# EAGLE design board (EAGLE 8.5.2)
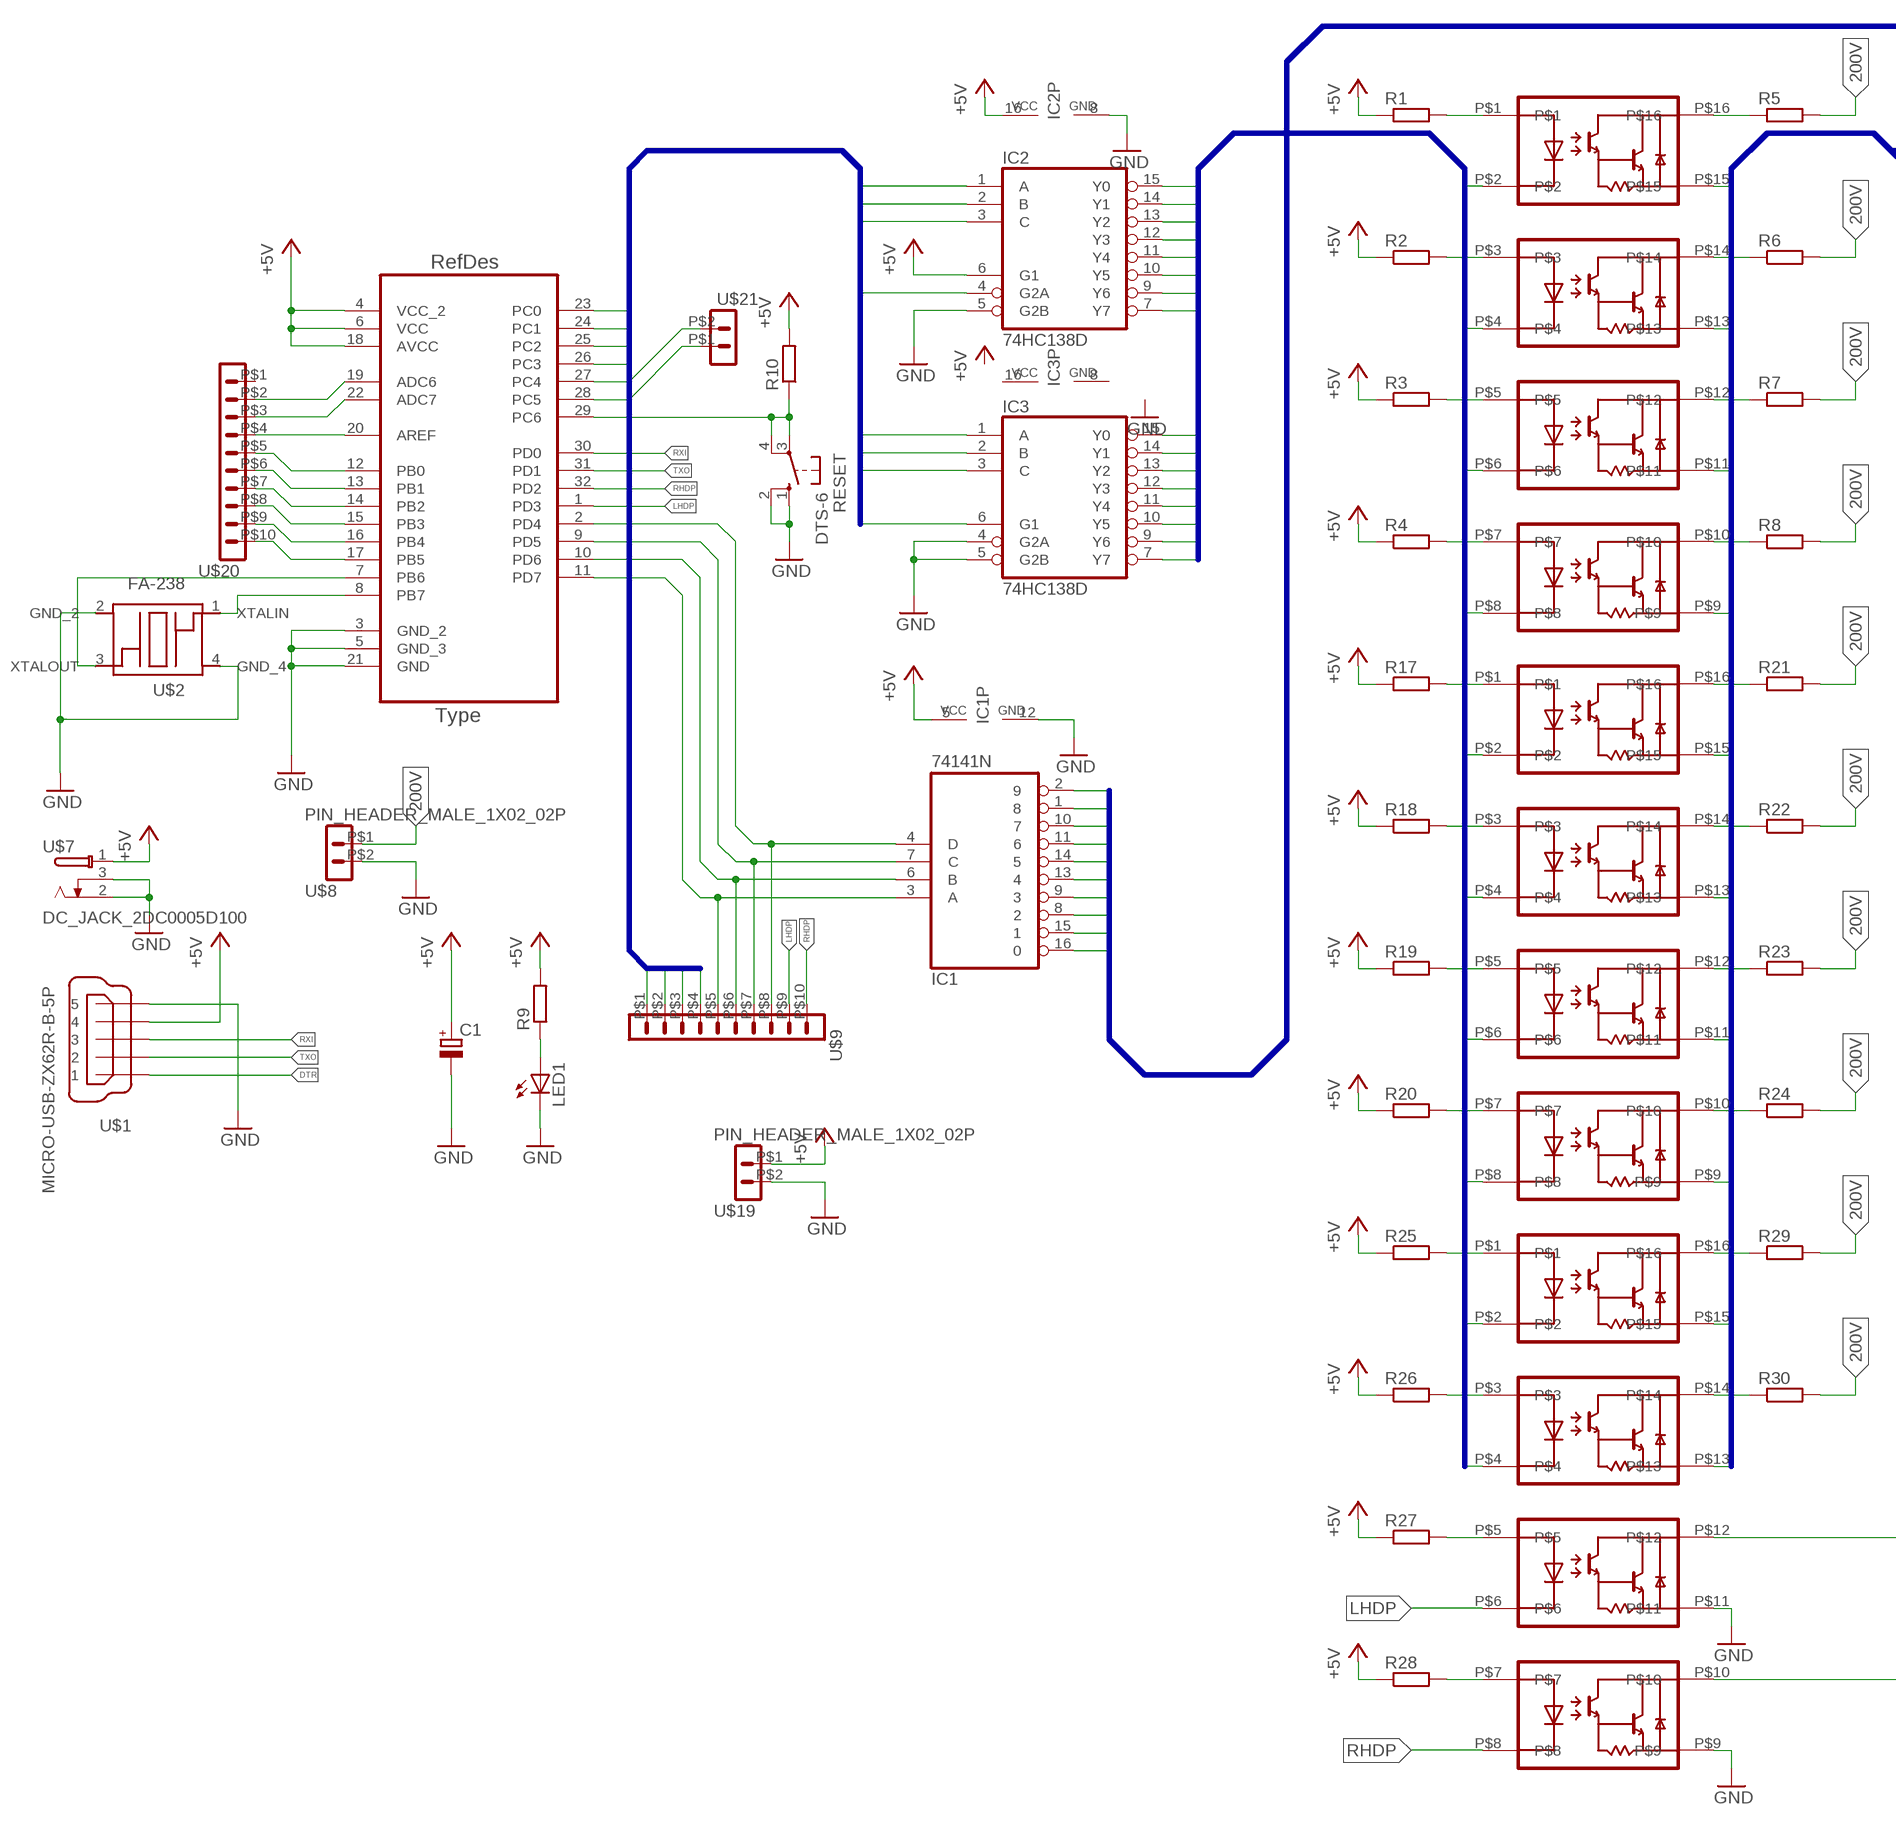
[diagram p0: schematic, sheet 1, part 1 of 2]
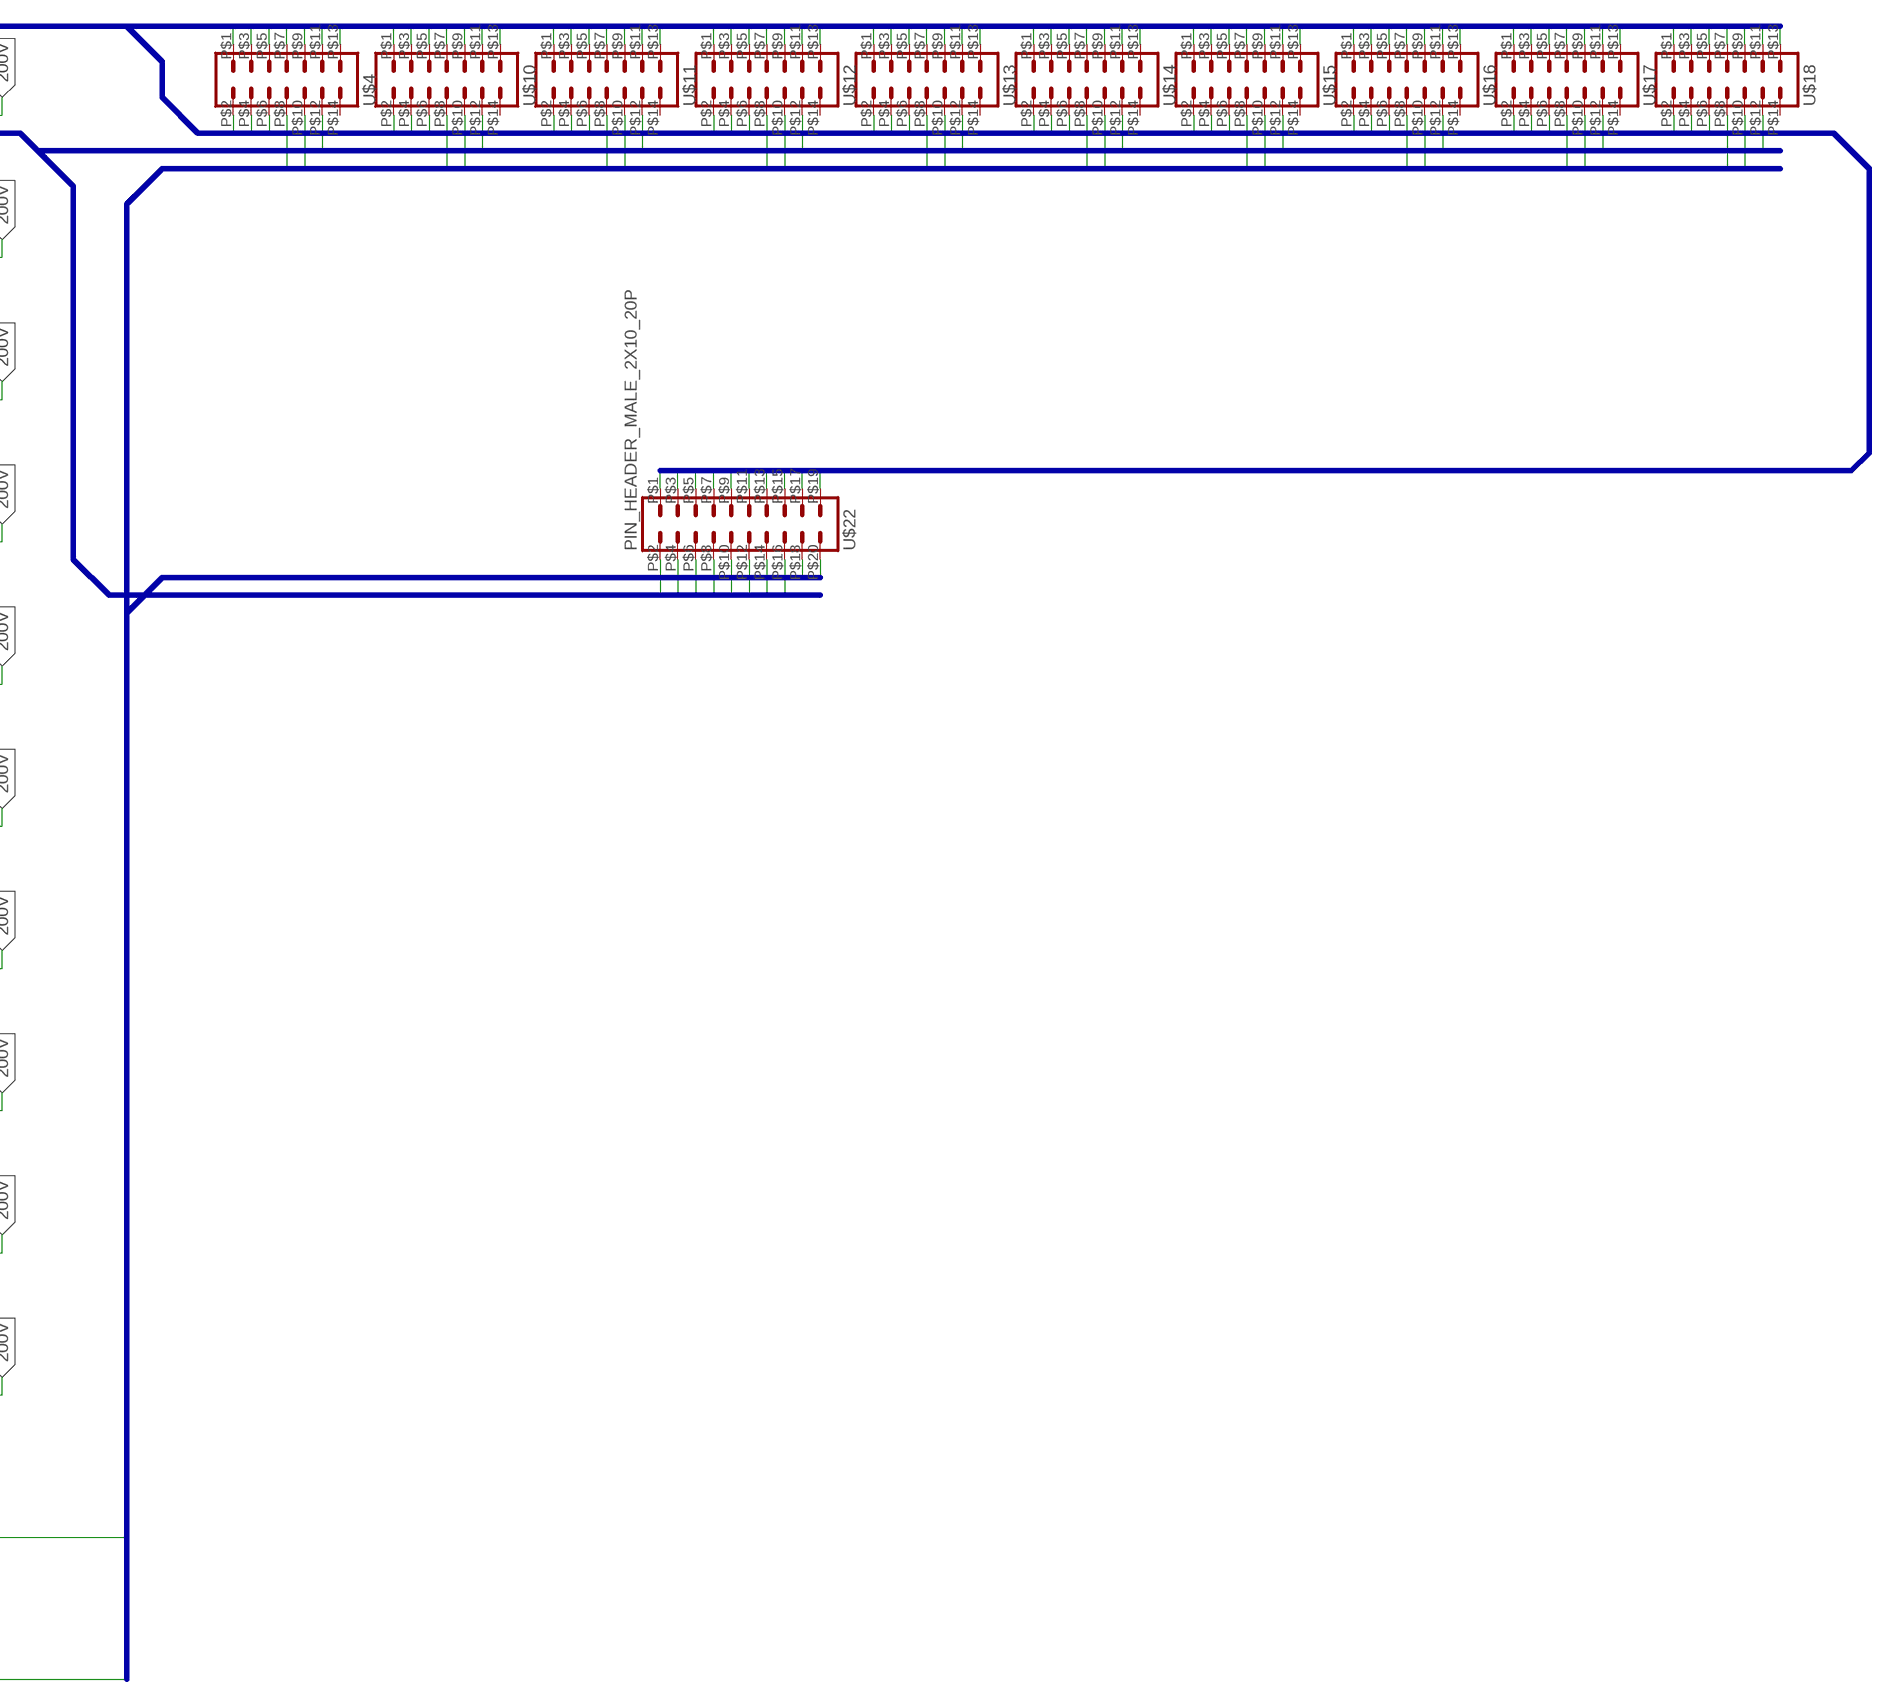
[diagram p1: schematic, sheet 1, part 2 of 2]

## Parts
C1  CPOL-EUE5-8.5  [E5-8,5]
IC1  74141N  [DIL16]
IC2  74HC138D  [SO16]
IC3  74HC138D  [SO16]
LED1  LEDSMT1206  [1206]
R1  R-EU_M3216  [M3216]
R2  R-EU_M3216  [M3216]
R3  R-EU_M3216  [M3216]
R4  R-EU_M3216  [M3216]
R5  R-EU_M3216  [M3216]
R6  R-EU_M3216  [M3216]
R7  R-EU_M3216  [M3216]
R8  R-EU_M3216  [M3216]
R9  R-EU_R3216  [R3216]
R10  R-EU_R3216  [R3216]
R17  R-EU_M3216  [M3216]
R18  R-EU_M3216  [M3216]
R19  R-EU_M3216  [M3216]
R20  R-EU_M3216  [M3216]
R21  R-EU_M3216  [M3216]
R22  R-EU_M3216  [M3216]
R23  R-EU_M3216  [M3216]
R24  R-EU_M3216  [M3216]
R25  R-EU_M3216  [M3216]
R26  R-EU_M3216  [M3216]
R27  R-EU_M3216  [M3216]
R28  R-EU_M3216  [M3216]
R29  R-EU_M3216  [M3216]
R30  R-EU_M3216  [M3216]
RESET  DTS-6  [DTS6]
U1  ATMEGA328P-AU  [QFP80P900X900X120-32N]
U$1  MICRO-USB-ZX62R-B-5P  [ZX62R-B-5P]
U$2  FA-238  [FA-238]
U$3  TLP627-4  [TLP627-4]
U$4  PIN_HEADER_MALE_2X07_14P  [PIN_HEADER_MALE_2X07_14P]
U$5  TLP627-4  [TLP627-4]
U$6  TLP627-4  [TLP627-4]
U$7  DC_JACK_2DC0005D100  [DC_JACK_2DC0005D100]
U$8  PIN_HEADER_MALE_1X02_02P  [PIN_HEADER_MALE_1X02_02P]
U$9  PIN_HEADER_MALE_1X10_10P  [PIN_HEADER_MALE_1X10_10P]
U$10  PIN_HEADER_MALE_2X07_14P  [PIN_HEADER_MALE_2X07_14P]
U$11  PIN_HEADER_MALE_2X07_14P  [PIN_HEADER_MALE_2X07_14P]
U$12  PIN_HEADER_MALE_2X07_14P  [PIN_HEADER_MALE_2X07_14P]
U$13  PIN_HEADER_MALE_2X07_14P  [PIN_HEADER_MALE_2X07_14P]
U$14  PIN_HEADER_MALE_2X07_14P  [PIN_HEADER_MALE_2X07_14P]
U$15  PIN_HEADER_MALE_2X07_14P  [PIN_HEADER_MALE_2X07_14P]
U$16  PIN_HEADER_MALE_2X07_14P  [PIN_HEADER_MALE_2X07_14P]
U$17  PIN_HEADER_MALE_2X07_14P  [PIN_HEADER_MALE_2X07_14P]
U$18  PIN_HEADER_MALE_2X07_14P  [PIN_HEADER_MALE_2X07_14P]
U$19  PIN_HEADER_MALE_1X02_02P  [PIN_HEADER_MALE_1X02_02P]
U$20  PIN_HEADER_MALE_1X10_10P  [PIN_HEADER_MALE_1X10_10P]
U$21  PIN_HEADER_MALE_1X02_02P  [PIN_HEADER_MALE_1X02_02P]
U$22  PIN_HEADER_MALE_2X10_20P  [PIN_HEADER_MALE_2X10_20P]

## Nets
200V: R5.2 R6.2 R7.2 R8.2 R21.2 R22.2 R23.2 R24.2 R29.2 R30.2 U$8.P$1
+5V: C1.+ IC1.5(VCC) IC2.6(G1) IC2.16(VCC) R1.1 R2.1 R3.1 R4.1 R9.2 R10.2 R17.1 R18.1 R19.1 R20.1 R25.1 R26.1 R27.1 R28.1 U1.4(VCC_2) U1.6(VCC) U1.18(AVCC) U$1.4 U$7.1 U$19.P$1
ANODE0: IC2.15(Y0) U$3.P$2
ANODE1: IC2.14(Y1) U$3.P$4
ANODE2: IC2.13(Y2) U$3.P$6
ANODE3: IC2.12(Y3) U$3.P$8
ANODE4: IC2.10(Y5) U$5.P$2
ANODE5: IC2.11(Y4) U$5.P$4
ANODE6: IC2.9(Y6) U$5.P$6
ANODE7: IC2.7(Y7) U$5.P$8
ANODE8: IC3.15(Y0) U$6.P$2
ANODE9: IC3.14(Y1) U$6.P$4
ANODE10: IC3.13(Y2)
ANODE11: IC3.12(Y3)
ANODE12: IC3.11(Y4)
ANODE13: IC3.10(Y5)
ANODE14: IC3.9(Y6)
ANODE15: IC3.7(Y7)
DOT0: U$4.P$8 U$6.P$12 U$10.P$8 U$11.P$8 U$12.P$8 U$13.P$8 U$14.P$8 U$15.P$8 U$16.P$8 U$17.P$8 U$18.P$8 U$22.P$18
DOT1: U$4.P$10 U$6.P$10 U$10.P$10 U$11.P$10 U$12.P$10 U$13.P$10 U$14.P$10 U$15.P$10 U$16.P$10 U$17.P$10 U$18.P$10 U$22.P$20
DTR: U$1.1
GND: C1.- IC1.12(GND) IC2.5(G2B) IC2.8(GND) IC3.4(G2A) IC3.5(G2B) LED1.C RESET.1(S) RESET.2(S1) U1.3(GND_2) U1.5(GND_3) U1.21(GND) U$1.5 U$2.2(GND_2) U$2.4(GND_4) U$6.P$9 U$6.P$11 U$7.2 U$7.3 U$8.P$2 U$19.P$2
LHDP: U1.1(PD3) U$6.P$6
N$1: U1.7(PB6) U$2.3(XTALOUT)
N$2: U1.8(PB7) U$2.1(XTALIN)
N$3: IC1.3(A) U1.11(PD7) U$9.P$5
N$4: IC1.6(B) U1.10(PD6) U$9.P$6
N$5: IC1.7(C) U1.9(PD5) U$9.P$7
N$6: IC1.4(D) U1.2(PD4) U$9.P$8
N$7: R1.2 U$3.P$1
N$8: R2.2 U$3.P$3
N$9: R3.2 U$3.P$5
N$10: R4.2 U$3.P$7
N$11: R8.1 U$3.P$10
N$12: R7.1 U$3.P$12
N$13: R6.1 U$3.P$14
N$14: R5.1 U$3.P$16
N$15: R10.1 RESET.3(P) RESET.4(P1) U1.29(PC6)
N$16: LED1.A R9.1
N$17: U1.17(PB5) U$20.P$10
N$18: U1.16(PB4) U$20.P$9
N$19: U1.15(PB3) U$20.P$8
N$20: U1.14(PB2) U$20.P$7
N$21: U1.13(PB1) U$20.P$6
N$22: U1.12(PB0) U$20.P$5
N$23: R17.2 U$5.P$1
N$24: R18.2 U$5.P$3
N$25: R19.2 U$5.P$5
N$26: R20.2 U$5.P$7
N$27: R24.1 U$5.P$10
N$28: R23.1 U$5.P$12
N$29: R22.1 U$5.P$14
N$30: R21.1 U$5.P$16
N$31: R25.2 U$6.P$1
N$32: R26.2 U$6.P$3
N$33: R27.2 U$6.P$5
N$34: R28.2 U$6.P$7
N$35: U1.20(AREF) U$20.P$4
N$36: U1.22(ADC7) U$20.P$3
N$37: R30.1 U$6.P$14
N$38: R29.1 U$6.P$16
N$39: U1.19(ADC6) U$20.P$2
N$40: U1.28(PC5) U$21.P$1
N$41: U1.27(PC4) U$21.P$2
NIX1: IC2.1(A) IC3.1(A) U1.26(PC3) U$9.P$1
NIX2: IC2.2(B) IC3.2(B) U1.25(PC2) U$9.P$2
NIX3: IC2.3(C) IC3.3(C) U1.24(PC1) U$9.P$3
NIX4: IC2.4(G2A) IC3.6(G1) U1.23(PC0) U$9.P$4
NIXIE0: IC1.16 U$4.P$1 U$10.P$1 U$11.P$1 U$12.P$1 U$13.P$1 U$14.P$1 U$15.P$1 U$16.P$1 U$17.P$1 U$18.P$1 U$22.P$1
NIXIE1: IC1.15 U$4.P$3 U$10.P$3 U$11.P$3 U$12.P$3 U$13.P$3 U$14.P$3 U$15.P$3 U$16.P$3 U$17.P$3 U$18.P$3 U$22.P$3
NIXIE2: IC1.8 U$4.P$5 U$10.P$5 U$11.P$5 U$12.P$5 U$13.P$5 U$14.P$5 U$15.P$5 U$16.P$5 U$17.P$5 U$18.P$5 U$22.P$5
NIXIE3: IC1.9 U$4.P$7 U$10.P$7 U$11.P$7 U$12.P$7 U$13.P$7 U$14.P$7 U$15.P$7 U$16.P$7 U$17.P$7 U$18.P$7 U$22.P$7
NIXIE4: IC1.13 U$4.P$9 U$10.P$9 U$11.P$9 U$12.P$9 U$13.P$9 U$14.P$9 U$15.P$9 U$16.P$9 U$17.P$9 U$18.P$9 U$22.P$9
NIXIE5: IC1.14 U$4.P$11 U$10.P$11 U$11.P$11 U$12.P$11 U$13.P$11 U$14.P$11 U$15.P$11 U$16.P$11 U$17.P$11 U$18.P$11 U$22.P$11
NIXIE6: IC1.11 U$4.P$13 U$10.P$13 U$11.P$13 U$12.P$13 U$13.P$13 U$14.P$13 U$15.P$13 U$16.P$13 U$17.P$13 U$18.P$13 U$22.P$13
NIXIE7: IC1.10 U$4.P$2 U$10.P$2 U$11.P$2 U$12.P$2 U$13.P$2 U$14.P$2 U$15.P$2 U$16.P$2 U$17.P$2 U$18.P$2 U$22.P$15
NIXIE8: IC1.1 U$4.P$4 U$10.P$4 U$11.P$4 U$12.P$4 U$13.P$4 U$14.P$4 U$15.P$4 U$16.P$4 U$17.P$4 U$18.P$4 U$22.P$17
NIXIE9: IC1.2 U$4.P$6 U$10.P$6 U$11.P$6 U$12.P$6 U$13.P$6 U$14.P$6 U$15.P$6 U$16.P$6 U$17.P$6 U$18.P$6 U$22.P$19
NIXIE_ANODE1: U$3.P$15 U$4.P$12 U$22.P$16
NIXIE_ANODE2: U$3.P$13 U$10.P$12 U$22.P$14
NIXIE_ANODE3: U$3.P$11 U$11.P$12 U$22.P$12
NIXIE_ANODE4: U$3.P$9 U$12.P$12 U$22.P$10
NIXIE_ANODE5: U$5.P$15 U$13.P$12 U$22.P$8
NIXIE_ANODE6: U$5.P$13 U$14.P$12 U$22.P$6
NIXIE_ANODE7: U$5.P$11 U$15.P$12 U$22.P$4
NIXIE_ANODE8: U$5.P$9 U$16.P$12 U$22.P$2
NIXIE_ANODE9: U$6.P$15 U$17.P$12
NIXIE_ANODE10: U$6.P$13 U$18.P$12
RHDP: U1.32(PD2) U$6.P$8
RXI: U1.30(PD0) U$1.3
TXO: U1.31(PD1) U$1.2
Unconnected: U$4.P$14 U$9.P$9 U$9.P$10 U$10.P$14 U$11.P$14 U$12.P$14 U$13.P$14 U$14.P$14 U$15.P$14 U$16.P$14 U$17.P$14 U$18.P$14 U$20.P$1

## Buses
NIX[1..4]
ANODE[0..15]
NIXIE_ANODE[1..16]
NIXIE[0..9]
DOT[0..1]

## Power pins joined to a net without a drawn wire
GND: IC3.8(GND)
VCC: IC3.16(VCC)

## Library data of the parts
C1 = 160713 Library by matsu:CPOL-EU: POLARIZED CAPACITOR, European symbol
IC1 = 74xx-eu:74*141: BCD to decimal DECODER/DRIVER
IC2 IC3 = 74xx-eu:74*138: 3-line to 8-line DECODER/DEMULTIPLEXER
LED1 = 160713 Library by matsu:LED: LED OSRAM: - CHIPLED LG R971, LG N971, LY N971, LG Q971, LY Q971, LO R971, LY R971 LH N974, LH R974 LS Q976, LO Q976, LY Q976 LO Q996 - Hyper CHIPLED LW Q18S LB Q993, LB Q99A, LB R99A - SideLED LS A670, LO A670, LY A670, LG A670, LP A670 LB A673, LV A673, LT A673, LW A673 LH A674 LY A675 LS A676, LA A676, LO A676, LY A676, LW A676 LS A679, LY A679, LG A679 - Hyper Micro SIDELED® LS Y876, LA Y876, LO Y876, LY Y876 LT Y87S - SmartLED LW L88C, LW L88S LB L89C, LB L89S, LG L890 LS L89K, LO L89K, LY L89K LS L896, LA L896, LO L896, LY L896 - TOPLED LS T670, LO T670, LY T670, LG T670, LP T670 LSG T670, LSP T670, LSY T670, LOP T670, LYG T670 LG T671, LOG T671, LSG T671 LB T673, LV T673, LT T673, LW T673 LH T674 LS T676, LA T676, LO T676, LY T676, LB T676, LH T676, LSB T676, LW T676 LB T67C, LV T67C, LT T67C, LS T67K, LO T67K, LY T67K, LW E67C LS E67B, LA E67B, LO E67B, LY E67B, LB E67C, LV E67C, LT E67C LW T67C LS T679, LY T679, LG T679 LS T770, LO T770, LY T770, LG T770, LP T770 LB T773, LV T773, LT T773, LW T773 LH T774 LS E675, LA E675, LY E675, LS T675 LS T776, LA T776, LO T776, LY T776, LB T776 LHGB T686 LT T68C, LB T68C - Hyper Mini TOPLED® LB M676 - Mini TOPLED Santana® LG M470 LS M47K, LO M47K, LY M47K Source: http://www.osram.convergy.de LUXEON: - LUMILED® LXK2-PW12-R00, LXK2-PW12-S00, LXK2-PW14-U00, LXK2-PW14-V00 LXK2-PM12-R00, LXK2-PM12-S00, LXK2-PM14-U00 LXK2-PE12-Q00, LXK2-PE12-R00, LXK2-PE12-S00, LXK2-PE14-T00, LXK2-PE14-U00 LXK2-PB12-K00, LXK2-PB12-L00, LXK2-PB12-M00, LXK2-PB14-N00, LXK2-PB14-P00, LXK2-PB14-Q00 LXK2-PR12-L00, LXK2-PR12-M00, LXK2-PR14-Q00, LXK2-PR14-R00 LXK2-PD12-Q00, LXK2-PD12-R00, LXK2-PD12-S00 LXK2-PH12-R00, LXK2-PH12-S00 LXK2-PL12-P00, LXK2-PL12-Q00, LXK2-PL12-R00 Source: www.luxeon.com KINGBRIGHT: KA-3528ASYC Source: www.kingbright.com
R1-R8 R17-R30 = resistor:R-EU_: RESISTOR, European symbol
R9 R10 = 160713 Library by matsu:R-EU_: RESISTOR, European symbol
RESET = 160713 Library by matsu:DTS-6: AKIZUKIDENSHI, Cosland Co,. Ltd. TACT SWITCH DTS-6 http://akizukidenshi.com/download/ds/cosland/DTS-6-V.PDF
U1 = Atmel-ATMEGA328P-AU:ATMEGA328P-AU; DESCRIPTION: 8-bit Microcontroller with In-System Programmable Flash; MPN: ATMEGA328P-AU; OC_FARNELL: 1715486; OC_NEWARK: 14R4631; PACKAGE: TQFP-32; SUPPLIER: Atmel
U$1 = con-hirose:MICRO-USB-: Hirose Micro USB Connector ZX62R-B-5P: Micro B, reverse (top mount) shell SMT Supplier: DigiKey H11574CT-ND Source: http://www.hirose.co.jp/cataloge_hp/e24200011.pdf
U$2 = crystals:FA-238
U$3 U$5 U$6 = 160713 Library by matsu:TLP627-4
U$4 U$10-U$18 = 160713 Library by matsu:PIN_HEADER_MALE_2X07_14P
U$7 = 160713 Library by matsu:DC_JACK_2DC0005D100: AKIZUKIDENSHI 2DC-0005D100 SINGATRON ENTERPRISE CO., LTD http://akizukidenshi.com/download/2DC-0005D100.pdf
U$8 U$19 U$21 = 160713 Library by matsu:PIN_HEADER_MALE_1X02_02P
U$9 U$20 = 160713 Library by matsu:PIN_HEADER_MALE_1X10_10P
U$22 = 160713 Library by matsu:PIN_HEADER_MALE_2X10_20P

## Net classes
0 default: width 0.381 mm, clearance 0.127 mm

## Board
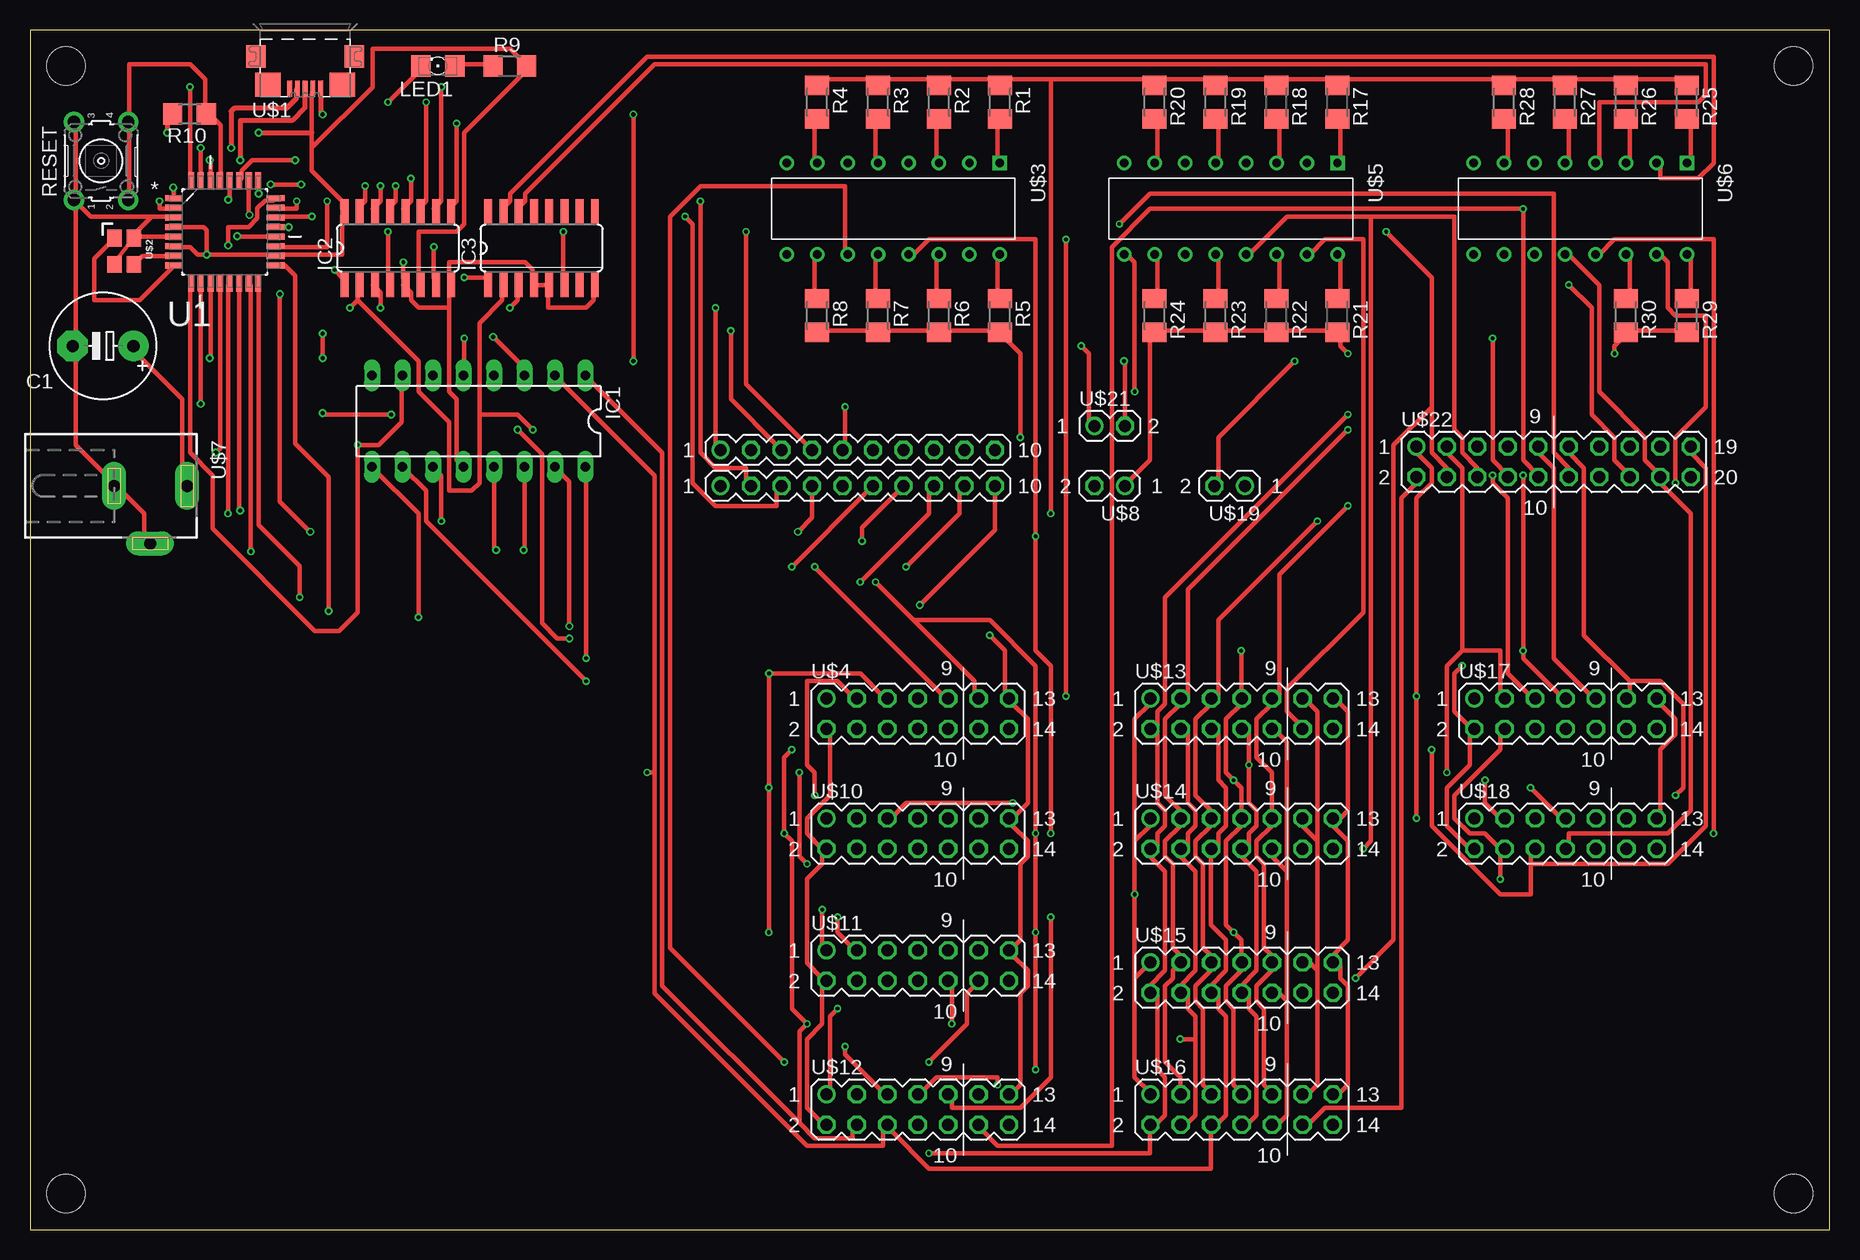
[diagram p2: board, top side]
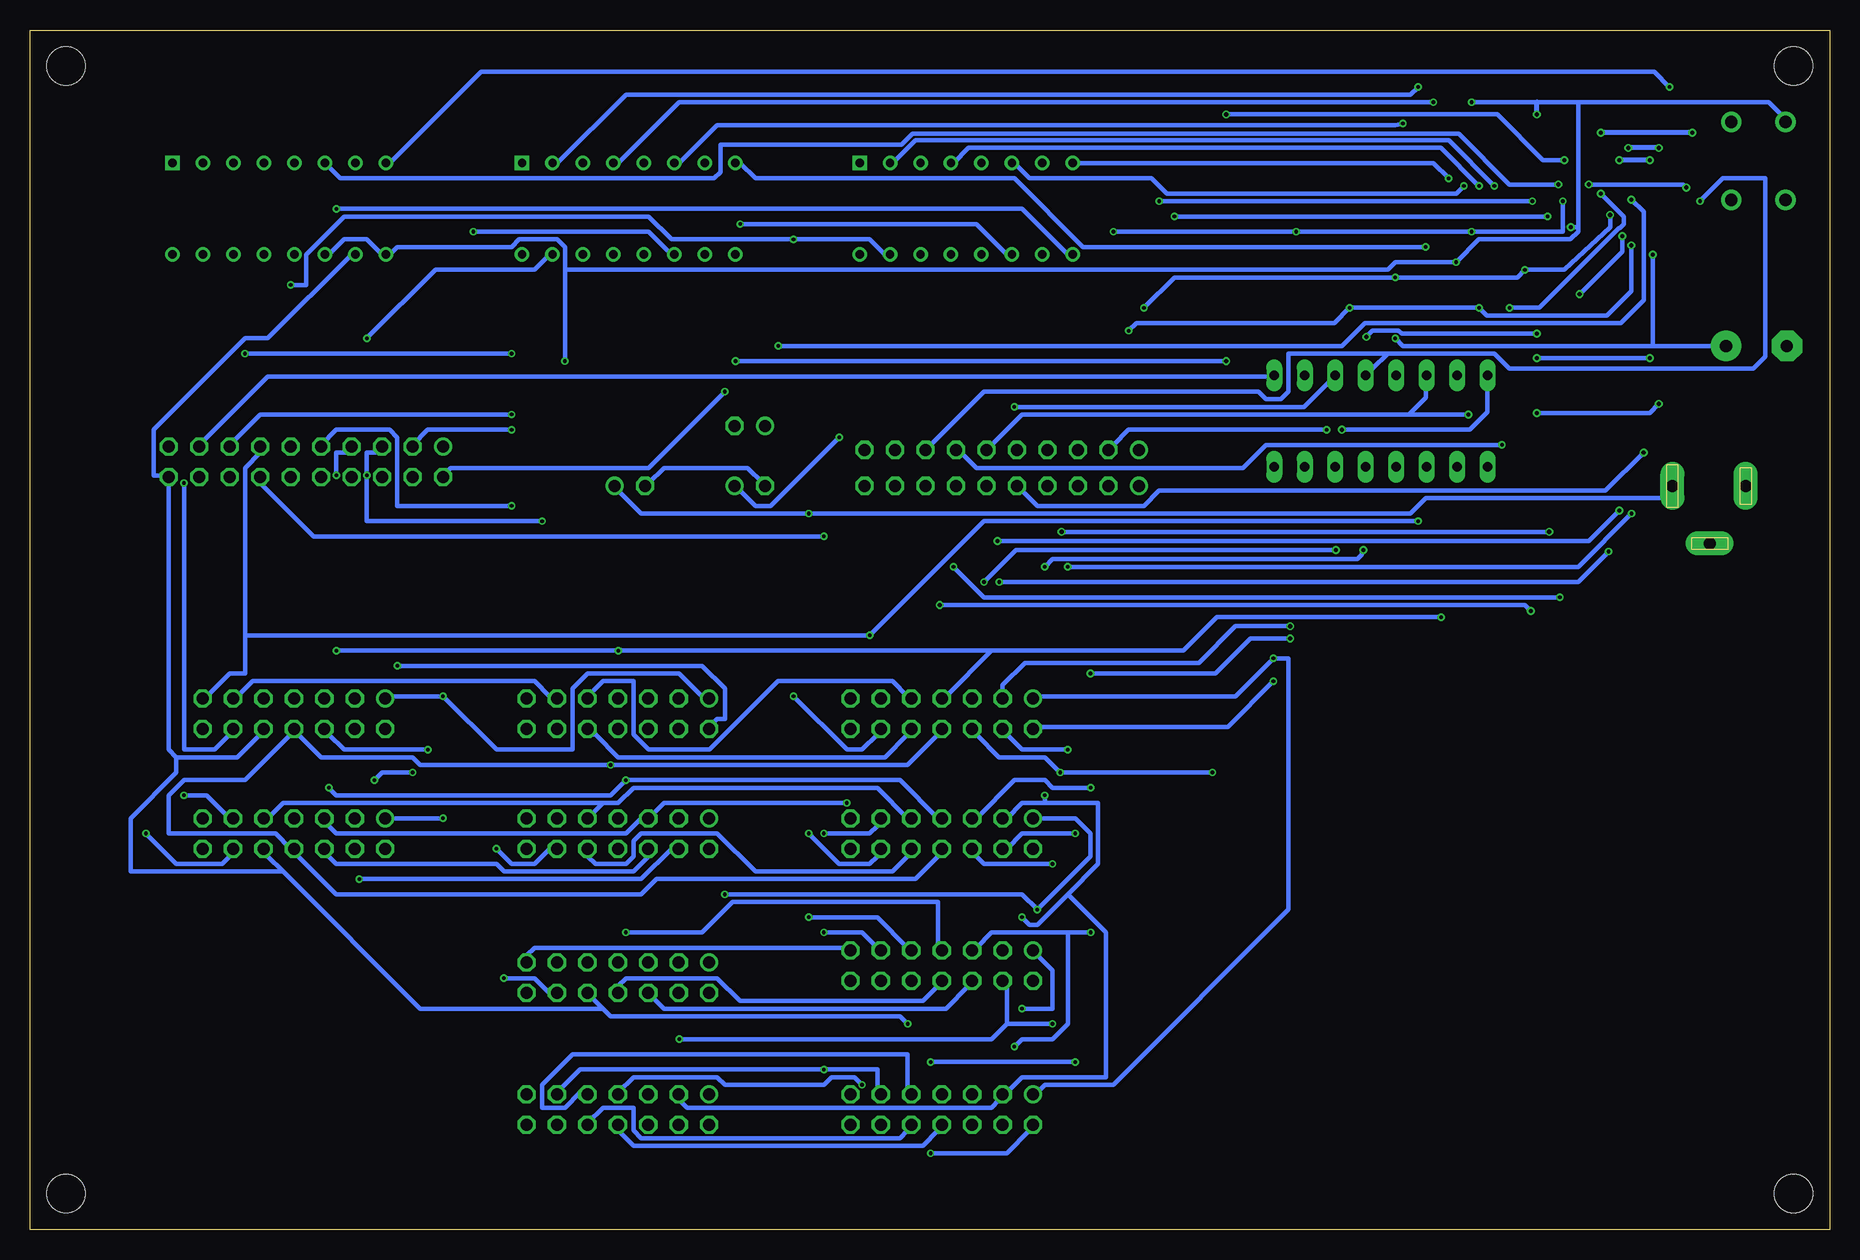
[diagram p3: board, bottom side, seen from below]

Size 150 x 100 mm. Coordinates in mm from the lower left corner, seen from the top.
Outline: 0,0 150,0 150,100 0,100 0,0
Copper layers (1*16): Top 0.035mm / dielectric 1.5mm / Bottom 0.035mm
Design rules "Elecrow_2-layer_eagle_rule": minimum track width 6mil, minimum drill 12mil, track to track 6mil, track to pad 6mil, pad to pad 6mil, via to via 6mil, smd to smd 0mil, copper to edge 10mil, drill to drill 10mil, minimum pad ring 10mil, minimum via ring 6mil, stop-mask expansion 2mil, vias tented up to drill 100mil, thermal gap 10mil
Holes 3.2 mm at 147,97 147,3 3,3 3,97

### Footprints (pad centres in the part's own frame; a part is rotated, then mirrored left to right if it is on the bottom)
E5-8,5 = drill 1.016 pad 2.54: + -2.54,0 | drill 1.016 pad 2.54 octagon: - 2.54,0
DIL16 = drill 0.813 long: 1 -8.89,-3.81; 2 -6.35,-3.81; 3 -3.81,-3.81; 4 -1.27,-3.81; 5 1.27,-3.81; 6 3.81,-3.81; 7 6.35,-3.81; 8 8.89,-3.81; 9 8.89,3.81; 10 6.35,3.81; 11 3.81,3.81; 12 1.27,3.81; 13 -1.27,3.81; 14 -3.81,3.81; 15 -6.35,3.81; 16 -8.89,3.81
SO16 = smd 0.66 x 2.032: 1 -4.445,-3.073; 2 -3.175,-3.073; 3 -1.905,-3.073; 4 -0.635,-3.073; 5 0.635,-3.073; 6 1.905,-3.073; 7 3.175,-3.073; 8 4.445,-3.073; 9 4.445,3.073; 10 3.175,3.073; 11 1.905,3.073; 12 0.635,3.073; 13 -0.635,3.073; 14 -1.905,3.073; 15 -3.175,3.073; 16 -4.445,3.073
1206 = smd 1.6 x 1.803: A -1.422,0; C 1.422,0
M3216 = smd 1.6 x 2: 1 -1.4,0; 2 1.4,0
R3216 = smd 1.6 x 1.8: 1 -1.4,0; 2 1.4,0
DTS6 = drill 1.016 pad 1.676: 1 -3.251,2.261; 2 3.251,2.261; 3 -3.251,-2.261; 4 3.251,-2.261
QFP80P900X900X120-32N = smd 1.473 x 0.508: 1 -4.242,2.794; 2 -4.242,2.007; 3 -4.242,1.194; 4 -4.242,0.406; 5 -4.242,-0.406; 6 -4.242,-1.194; 7 -4.242,-2.007; 8 -4.242,-2.794; 17 4.242,-2.794; 18 4.242,-2.007; 19 4.242,-1.194; 20 4.242,-0.406; 21 4.242,0.406; 22 4.242,1.194; 23 4.242,2.007; 24 4.242,2.794 | smd 0.508 x 1.473: 9 -2.794,-4.242; 10 -2.007,-4.242; 11 -1.194,-4.242; 12 -0.406,-4.242; 13 0.406,-4.242; 14 1.194,-4.242; 15 2.007,-4.242; 16 2.794,-4.242; 25 2.794,4.242; 26 2.007,4.242; 27 1.194,4.242; 28 0.406,4.242; 29 -0.406,4.242; 30 -1.194,4.242; 31 -2.007,4.242; 32 -2.794,4.242
ZX62R-B-5P = smd 1.35 x 0.4: 1 2.675,-1.3; 2 2.675,-0.65; 3 2.675,0; 4 2.675,0.65; 5 2.675,1.3 | smd 1.9 x 1.6: M1 0,-4.1; M2 0,4.1 | smd 2 x 2.1: M3 2.35,3.1; M4 2.35,-3.1
FA-238 = smd 1.4 x 1.2: 1 0,-1.6; 2 2.2,-1.6; 3 2.2,0; 4 0,0
TLP627-4 = drill 0.7 square: P$1 0,0 | drill 0.7: P$2 0,-2.54; P$3 0,-5.08; P$4 0,-7.62; P$5 0,-10.16; P$6 0,-12.7; P$7 0,-15.24; P$8 0,-17.78; P$9 7.62,-17.78; P$10 7.62,-15.24; P$11 7.62,-12.7; P$12 7.62,-10.16; P$13 7.62,-7.62; P$14 7.62,-5.08; P$15 7.62,-2.54; P$16 7.62,0
PIN_HEADER_MALE_2X07_14P = drill 1: P$1 -7.62,1.27 | drill 1 octagon: P$2 -7.62,-1.27; P$3 -5.08,1.27; P$4 -5.08,-1.27; P$5 -2.54,1.27; P$6 -2.54,-1.27; P$7 0,1.27; P$8 0,-1.27; P$9 2.54,1.27; P$10 2.54,-1.27; P$11 5.08,1.27; P$12 5.08,-1.27; P$13 7.62,1.27; P$14 7.62,-1.27
DC_JACK_2DC0005D100 = drill 1 pad 2 long: 1 -3.1,0; 2 3,0; 3 0,4.8
PIN_HEADER_MALE_1X02_02P = drill 1: P$1 -1.27,0 | drill 1 octagon: P$2 1.27,0
PIN_HEADER_MALE_1X10_10P = drill 1: P$1 -11.43,0 | drill 1 octagon: P$2 -8.89,0; P$3 -6.35,0; P$4 -3.81,0; P$5 -1.27,0; P$6 1.27,0; P$7 3.81,0; P$8 6.35,0; P$9 8.89,0; P$10 11.43,0
PIN_HEADER_MALE_2X10_20P = drill 1: P$1 -11.43,1.27 | drill 1 octagon: P$2 -11.43,-1.27; P$3 -8.89,1.27; P$4 -8.89,-1.27; P$5 -6.35,1.27; P$6 -6.35,-1.27; P$7 -3.81,1.27; P$8 -3.81,-1.27; P$9 -1.27,1.27; P$10 -1.27,-1.27; P$11 1.27,1.27; P$12 1.27,-1.27; P$13 3.81,1.27; P$14 3.81,-1.27; P$15 6.35,1.27; P$16 6.35,-1.27; P$17 8.89,1.27; P$18 8.89,-1.27; P$19 11.43,1.27; P$20 11.43,-1.27

### Placement (x,y rotation side)
C1  6.09,73.65 180 top
IC1  37.4,67.39 180 top
IC2  30.67,81.82 0 top
IC3  42.64,81.82 0 top
LED1  34,97 180 top
R1  80.85,93.98 270 top
R2  75.77,93.98 270 top
R3  70.69,93.98 270 top
R4  65.61,93.98 270 top
R5  80.85,76.2 270 top
R6  75.77,76.2 270 top
R7  70.69,76.2 270 top
R8  65.61,76.2 270 top
R9  40,97 0 top
R10  13.3,92.99 180 top
R17  108.98,93.98 270 top
R18  103.9,93.98 270 top
R19  98.82,93.98 270 top
R20  93.74,93.98 270 top
R21  108.98,76.2 270 top
R22  103.9,76.2 270 top
R23  98.82,76.2 270 top
R24  93.74,76.2 270 top
R25  138.11,93.98 270 top
R26  133.03,93.98 270 top
R27  127.95,93.98 270 top
R28  122.87,93.98 270 top
R29  138.11,76.2 270 top
R30  133.03,76.2 270 top
RESET  5.92,89.09 90 top
U1  16.24,83.17 0 top
U$1  22.94,97.79 270 top
U$2  8.65,82.66 270 top
U$3  80.85,88.9 270 top
U$4  74,43 0 top
U$5  108.98,88.9 270 top
U$6  138.11,88.9 270 top
U$7  10,62 180 top
U$8  90,62 180 top
U$9  69,65 0 top
U$10  74,33 0 top
U$11  74,22 0 top
U$12  74,10 0 top
U$13  101,43 0 top
U$14  101,33 0 top
U$15  101,21 0 top
U$16  101,10 0 top
U$17  128,43 0 top
U$18  128,33 0 top
U$19  100,62 180 top
U$20  69,62 0 top
U$21  90,67 0 top
U$22  127,64 0 top

### Tracks (layer width: path | path; a pad name or v marks a point on that pad's centre or on a via)
200V  (via drill 0.3)
  Top 0.381: R8.2 66.04,74.93 70.48,74.93 R7.2 71.12,74.93 75.56,74.93 R6.2 76.2,74.93 80.64,74.93 R5.2 81.28,74.3 82.55,73.03 v82.55,66.04 | R29.2 137.79,74.93 133.35,74.93 R30.2 132.72,74.3 132.08,73.66 v132.08,73.03 | U$8.P$1 91.44,62.23 93.34,64.14 93.34,74.3 R24.2 93.98,74.93 98.42,74.93 R23.2 99.06,74.93 103.5,74.93 R22.2 104.14,74.93 108.58,74.93 R21.2 109.22,74.3 109.22,73.66 v109.86,73.03
  Bottom 0.381: v109.86,73.03 v132.08,73.03 | v82.55,66.04 88.27,60.33 89.53,60.33 90.81,61.59 U$8.P$1
+5V  (via drill 0.3, 0.35)
  Top 0.381: R25.1 137.79,95.89 133.35,95.89 R26.1 132.72,95.89 128.27,95.89 R27.1 127.64,95.89 123.19,95.89 R28.1 122.56,95.89 109.22,95.89 R17.1 108.58,95.89 104.14,95.89 R18.1 103.5,95.89 99.06,95.89 R19.1 98.42,95.89 93.98,95.89 R20.1 93.34,95.89 85.09,95.89 | R4.1 66.04,95.89 70.48,95.89 R3.1 71.12,95.89 75.56,95.89 R2.1 76.2,95.89 80.64,95.89 R1.1 81.28,95.89 85.09,95.89 | IC2.6 32.38,79.38 32.38,83.19 35.56,83.19 36.2,83.82 36.2,91.44 41.27,96.52 R9.2 41.27,97.16 40.01,98.42 28.57,98.42 28.57,95.25 23.5,90.17 | 23.5,90.17 23.5,88.27 26.04,85.72 26.04,85.09 IC2.16 26.04,84.45 26.04,81.28 20.95,81.28 U1.18 20.32,81.28 v14.73,81.28 | 23.5,90.17 23.5,91.44 23.5,94.61 U$1.4 | 11.43,92.71 R10.2 | 11.43,81.92 U1.6 12.06,81.92 13.34,81.92 13.97,81.28 v14.73,81.28 | 8.89,73.66 C1.+ 8.89,73.03 12.7,69.22 12.7,62.23 U$7.1 | v36.2,74.3 36.2,71.75 IC1.5 | v85.09,59.69 85.09,95.89 | U1.4 14.47,83.58 14.73,83.31 v14.73,81.28
  Top 0.432: R10.2 11.43,92.52 v11.43,91.44 | v19.05,91.44 23.5,91.44
  Bottom 0.381: v36.2,74.3 35.56,73.66 14.73,73.66 | 14.73,73.66 8.89,73.66 C1.+ | U$19.P$1 100.97,61.59 99.06,59.69 v85.09,59.69 34.92,59.69 33.66,60.96 13.97,60.96 13.34,61.59 U$7.1 | v14.73,81.28 14.73,73.66
  Bottom 0.432: v11.43,91.44 v19.05,91.44
ANODE0  (via drill 0.3)
  Top 0.381: v27.94,87 27.94,85.72 27.3,85.09 IC2.15
  Bottom 0.381: v27.94,87 31.75,90.81 76.2,90.81 78.11,88.9 U$3.P$2
ANODE1  (via drill 0.3)
  Top 0.381: v29.21,87 29.21,85.72 28.57,85.09 IC2.14
  Bottom 0.381: v29.21,87 32.38,90.17 71.75,90.17 73.03,88.9 U$3.P$4
ANODE2  (via drill 0.3)
  Top 0.381: v30.48,87 30.48,85.72 29.84,85.09 IC2.13
  Bottom 0.381: v30.48,87 31.11,86.36 55.24,86.36 56.52,87.63 66.67,87.63 67.94,88.9 U$3.P$6
ANODE3  (via drill 0.3)
  Top 0.381: v31.75,87.63 31.75,85.72 31.11,85.09 IC2.12
  Bottom 0.381: v31.75,87.63 33.02,88.9 U$3.P$8
ANODE4  (via drill 0.3)
  Top 0.381: v34.29,95.25 34.29,85.72 33.66,85.09 IC2.10
  Bottom 0.381: v34.29,95.25 34.92,94.61 100.33,94.61 106.05,88.9 U$5.P$2
ANODE5  (via drill 0.3)
  Top 0.381: v33.02,93.98 33.02,85.72 32.38,85.09 IC2.11
  Bottom 0.381: v33.02,93.98 95.89,93.98 100.97,88.9 U$5.P$4
ANODE6  (via drill 0.3)
  Top 0.381: v35.56,92.2 35.56,85.72 34.92,85.09 IC2.9
  Bottom 0.381: v35.56,92.2 36.2,92.08 92.71,92.08 95.89,88.9 U$5.P$6
ANODE7  (via drill 0.3)
  Top 0.381: v33.66,81.92 33.66,79.38 IC2.7
  Bottom 0.381: v33.66,81.92 62.23,81.92 67.94,87.63 89.53,87.63 90.81,88.9 U$5.P$8
ANODE8
  Top 0.381: IC3.15 39.37,85.09 40.01,85.72 40.01,86.36 51.44,97.79 140.34,97.79 140.34,88.9 139.06,87.63 135.89,87.63 135.89,88.9 U$6.P$2
ANODE9
  Top 0.381: IC3.14 40.64,85.09 41.27,85.72 41.27,86.36 52.07,97.16 139.7,97.16 139.7,94.61 139.06,93.98 130.81,93.98 130.81,88.9 U$6.P$4
DOT0  (via drill 0.3)
  Top 0.381: U$13.P$8 101.6,41.27 v101.6,38.73 101.6,35.56 102.23,34.92 102.23,33.66 101.6,33.02 101.6,31.75 U$14.P$8 100.97,31.11 102.23,29.84 102.23,21.59 100.97,20.32 U$15.P$8 101.6,19.68 101.6,18.41 102.23,17.78 102.23,9.53 101.6,8.89 U$16.P$8 | U$6.P$12 128.27,81.28 130.81,78.74 130.81,69.85 134.62,66.04 134.62,64.14 135.89,62.87 U$22.P$18 135.89,62.23 138.43,59.69 138.43,34.92 136.53,33.02 128.27,33.02 128.27,31.75 U$18.P$8
  Bottom 0.381: U$12.P$8 74.3,8.26 75.56,6.99 99.69,6.99 100.97,8.26 U$16.P$8 | U$11.P$8 74.3,20.32 75.56,19.05 90.81,19.05 92.71,20.95 100.33,20.95 100.97,20.32 U$15.P$8 | U$4.P$8 74.3,41.27 76.83,38.73 v101.6,38.73 117.47,38.73 118.11,39.37 125.73,39.37 127.64,41.27 U$17.P$8 128.27,41.27 132.08,37.47 137.16,37.47 138.43,36.2 138.43,33.02 129.54,33.02 128.27,31.75 U$18.P$8 127.64,31.11 124.46,27.94 99.06,27.94 97.79,29.21 76.2,29.21 74.3,31.11 U$10.P$8
DOT1  (via drill 0.3)
  Top 0.381: v76.83,17.14 76.83,20.32 U$11.P$10 | 104.78,19.05 104.78,9.53 104.14,8.89 U$16.P$10 | 104.78,19.05 104.14,19.68 U$15.P$10 | 104.78,29.84 103.5,31.11 U$14.P$10 | 104.78,19.05 104.78,29.84 | 104.78,29.84 104.78,40.64 104.14,41.27 U$13.P$10
  Bottom 0.381: U$6.P$10 123.19,81.28 130.18,74.3 132.08,74.3 139.7,66.67 139.7,62.87 138.43,62.87 U$22.P$20 138.43,40.01 137.79,39.37 | 137.79,39.37 132.72,39.37 130.81,41.27 U$17.P$10 | U$4.P$10 76.83,41.27 78.74,39.37 100.97,39.37 102.87,41.27 103.5,41.27 U$13.P$10 | U$10.P$10 76.83,31.11 78.11,29.84 89.53,29.84 92.71,33.02 99.06,33.02 99.69,32.38 99.69,31.11 100.33,30.48 102.87,30.48 103.5,31.11 U$14.P$10 | U$12.P$10 76.83,8.26 77.47,7.62 99.06,7.62 99.69,8.26 99.69,10.16 102.23,10.16 103.5,8.89 U$16.P$10 | v76.83,17.14 77.47,17.78 101.6,17.78 102.23,18.41 | 102.23,18.41 103.5,19.68 U$15.P$10 | 128.91,29.84 117.47,18.41 102.23,18.41 | 128.91,29.84 130.18,31.11 U$18.P$10 | 137.79,39.37 137.79,38.1 141.6,34.29 141.6,29.84 128.91,29.84
GND  (via drill 0.3, 0.35)
  Top 0.381: v105.41,72.39 99.06,66.04 99.06,62.23 U$19.P$2 | U$7.3 9.53,57.78 9.53,59.69 7.62,61.59 U$7.2 6.99,62.23 3.81,65.41 3.81,73.03 C1.- 3.81,73.66 4.06,73.91 3.81,74.17 3.81,85.72 RESET.1 | 6.99,80.64 U$2.2 | U$2.2 7.37,80.39 7.37,81.03 8.26,82.17 8.26,82.55 U$2.4 8.79,82.96 | 10.16,84.45 11.43,84.45 U1.3 | 10.16,84.45 8.89,83.19 8.79,82.96 | 6.99,80.01 U$2.2 | 43.18,78.74 41.91,78.74 IC3.4 41.91,79.38 41.91,80.01 41.27,80.64 34.92,80.64 34.92,79.38 IC2.8 34.92,78.74 34.92,76.83 | 43.18,78.74 43.18,76.83 46.35,76.83 46.99,77.47 46.99,78.74 IC3.8 | 43.18,78.74 IC3.5 | 34.92,76.83 32.38,76.83 31.75,77.47 31.75,78.11 31.11,78.74 IC2.5 31.11,79.38 v31.11,80.64 | 34.92,76.83 34.92,69.85 35.56,69.22 35.56,64.14 IC1.12 | v29.84,93.98 32.38,96.52 LED1.C | RESET.1 3.81,86.36 3.81,92.08 RESET.2 | RESET.1 5.04,84.45 10.16,84.45 | U1.5 8.99,82.76 8.79,82.96 | v21.55,83.57 20.49,83.57 U1.21
  Top 0.432: U$1.5 24.24,93.11 v24.38,92.96
  Bottom 0.381: U$6.P$11 125.09,81.28 123.83,82.55 121.92,82.55 120.65,81.28 U$6.P$9 120.02,81.28 119.38,81.92 109.86,81.92 109.22,82.55 106.05,82.55 105.41,81.92 105.41,80.01 | U$8.P$2 88.9,62.23 90.17,63.5 97.16,63.5 98.42,62.23 U$19.P$2 | v105.41,72.39 105.41,80.01 | 20.95,93.98 5.08,93.98 3.81,92.71 RESET.2 | 20.95,93.98 24.38,93.98 v29.84,93.98 | 20.95,93.98 20.95,85.85 20.95,83.57 | 20.95,83.57 20.95,83.19 21.59,82.55 29.21,82.55 v31.11,80.64 36.2,80.64 36.83,80.01 105.41,80.01 | 20.95,83.57 v21.55,83.57
  Bottom 0.432: v24.38,92.96 24.38,93.98
LHDP  (via drill 0.35)
  Top 0.381: v22.61,87.12 v20.07,87.12 | v11.94,86.87 12,86.81 U1.1
  Bottom 0.381: U$6.P$6 124.14,87.63 92.96,87.63 92.46,88.14 92.46,90.42 77.33,90.42 76.42,91.34 30.89,91.34 26.67,87.12 v22.61,87.12 | v20.07,87.12 12.19,87.12 v11.94,86.87
N$1
  Top 0.381: U$2.3 9.36,81.16 U1.7
N$2
  Top 0.381: U$2.1 5.33,80.94 5.33,77.47 9.14,77.47 12,80.32 U1.8
N$3  (via drill 0.3, 0.35)
  Top 0.381: v67.94,68.58 67.94,65.41 U$9.P$5 | U1.11 15.05,72.7 v14.99,72.64 | v24.38,72.64 v24.38,74.68 | v38.61,74.42 41.21,71.82 IC1.3
  Bottom 0.381: v67.94,68.58 43.81,68.58 41.27,71.12 IC1.3 | v14.99,72.64 v24.38,72.64 | v24.38,74.68 35.66,74.68 35.93,74.94 38.09,74.94 v38.61,74.42
N$4  (via drill 0.35)
  Top 0.381: v30.1,67.94 24.51,67.94 v24.38,68.07 | v14.22,68.83 14.22,78.92 U1.10
  Bottom 0.381: 35.05,67.94 67.31,67.94 69.85,65.41 U$9.P$6 | IC1.6 33.66,71.12 33.66,69.34 35.05,67.94 | 35.05,67.94 v30.1,67.94 | v24.38,68.07 14.99,68.07 v14.22,68.83
N$5  (via drill 0.3)
  Top 0.381: U1.9 13.34,78.74 13.34,64.77 15.24,62.87 15.24,58.42 23.75,49.91 25.78,49.91 27.3,51.44 v27.3,65.41 29.08,65.41 30.99,67.31 30.99,71.14 IC1.7
  Bottom 0.381: v27.3,65.41 46.99,65.41 48.9,63.5 71.12,63.5 72.39,64.77 U$9.P$7
N$6  (via drill 0.3)
  Top 0.381: v10.79,85.72 10.79,85.09 11.43,85.09 U1.2
  Bottom 0.381: 36.83,73.03 27.94,73.03 26.67,71.75 6.35,71.75 5.33,72.77 5.33,87.63 8.89,87.63 v10.79,85.72 | 36.83,73.03 38.1,71.75 IC1.4 | 36.83,73.03 45.09,73.03 45.09,69.85 45.72,69.22 46.99,69.22 47.62,69.85 70.48,69.85 74.93,65.41 U$9.P$8
N$7
  Top 0.381: R1.2 80.64,92.08 80.64,88.9 U$3.P$1
N$8
  Top 0.381: R2.2 75.56,92.08 75.56,88.9 U$3.P$3
N$9
  Top 0.381: R3.2 70.48,92.08 70.48,88.9 U$3.P$5
N$10
  Top 0.381: R4.2 65.41,92.08 65.41,88.9 U$3.P$7
N$11
  Top 0.381: R8.1 65.41,78.11 65.41,81.28 U$3.P$10
N$12
  Top 0.381: R7.1 70.48,78.11 70.48,81.28 U$3.P$12
N$13
  Top 0.381: R6.1 75.56,78.11 75.56,81.28 U$3.P$14
N$14
  Top 0.381: R5.1 80.64,78.11 80.64,81.28 U$3.P$16
N$15
  Top 0.381: U1.29 15.88,87.63 15.88,92.08 15.24,92.71 R10.1 14.61,93.34 14.61,95.89 13.34,97.16 8.26,97.16 8.26,92.71 RESET.4 8.26,92.08 8.26,86.36 RESET.3
N$16
  Top 0.381: R9.1 38.1,97.16 35.56,97.16 LED1.A
N$17  (via drill 0.35)
  Top 0.381: U$20.P$10 80.43,58.33 v74.17,52.07 | v24.89,51.56 24.89,62.74 22.1,65.53 22.1,79.5 21.22,80.38 U1.17
  Bottom 0.381: v24.89,51.56 25.4,52.07 v74.17,52.07
N$18  (via drill 0.3)
  Top 0.381: v73.03,55.24 77.47,59.69 77.47,61.59 U$20.P$9 | U1.16 19.05,78.74 19.05,58.74 22.48,55.31 v22.48,52.7
  Bottom 0.381: v73.03,55.24 70.48,52.7 v22.48,52.7
N$19  (via drill 0.3)
  Top 0.381: v18.41,56.52 18.41,78.74 U1.15 | v69.22,53.98 74.93,59.69 74.93,61.59 U$20.P$8
  Bottom 0.381: v18.41,56.52 20.95,53.98 v69.22,53.98
N$20  (via drill 0.35)
  Top 0.381: U$20.P$7 69.34,58.53 v69.34,57.4 | U1.14 17.43,60.04 v17.53,59.94
  Bottom 0.381: v69.34,57.4 20.07,57.4 v17.53,59.94
N$21  (via drill 0.3)
  Top 0.381: v16.51,59.69 16.51,78.74 U1.13 | v63.5,55.24 69.85,61.59 U$20.P$6
  Bottom 0.381: v16.51,59.69 20.95,55.24 v63.5,55.24
N$22  (via drill 0.35)
  Top 0.381: U1.12 15.83,65.11 v15.49,64.77
  Bottom 0.381: U$20.P$5 67.31,61.59 66.04,60.33 57.15,60.33 55.88,61.59 18.67,61.59 v15.49,64.77
N$23
  Top 0.381: R17.2 109.22,92.08 109.22,88.9 U$5.P$1
N$24
  Top 0.381: R18.2 104.14,92.08 104.14,88.9 U$5.P$3
N$25
  Top 0.381: R19.2 99.06,92.08 99.06,88.9 U$5.P$5
N$26
  Top 0.381: R20.2 93.98,92.08 93.98,88.9 U$5.P$7
N$27
  Top 0.381: R24.1 93.98,78.11 93.98,81.28 U$5.P$10
N$28
  Top 0.381: R23.1 99.06,78.11 99.06,81.28 U$5.P$12
N$29
  Top 0.381: R22.1 104.14,78.11 104.14,81.28 U$5.P$14
N$30
  Top 0.381: R21.1 109.22,78.11 109.22,81.28 U$5.P$16
N$31
  Top 0.381: R25.2 138.43,92.08 138.43,88.9 U$6.P$1
N$32
  Top 0.381: R26.2 133.35,92.08 133.35,88.9 U$6.P$3
N$33
  Top 0.381: R27.2 128.27,92.08 128.27,88.9 U$6.P$5
N$34
  Top 0.381: R28.2 123.19,92.08 123.19,88.9 U$6.P$7
N$35  (via drill 0.35)
  Top 0.381: U$20.P$4 65.19,59.35 v64.01,58.17 | v23.37,58.17 20.83,60.71 v20.83,77.98 | v17.27,82.8 17.31,82.76 U1.20
  Bottom 0.381: v64.01,58.17 v23.37,58.17 | v20.83,77.98 18.29,80.52 18.03,80.77 17.27,81.53 v17.27,82.8
N$36  (via drill 0.3)
  Top 0.381: v23.5,84.45 20.95,84.45 U1.22 | v54.61,84.45 55.24,83.82 55.24,62.23 57.15,60.33 62.23,60.33 62.23,61.59 U$20.P$3
  Bottom 0.381: v54.61,84.45 v23.5,84.45
N$37
  Top 0.381: R30.1 133.35,78.11 133.35,81.28 U$6.P$14
N$38
  Top 0.381: R29.1 138.43,78.11 138.43,81.28 U$6.P$16
N$39  (via drill 0.3)
  Top 0.381: v24.77,85.72 24.77,81.92 20.95,81.92 U1.19 | v55.88,85.72 55.88,64.77 57.15,63.5 59.69,63.5 59.69,62.23 U$20.P$2
  Bottom 0.381: v55.88,85.72 v24.77,85.72
N$40  (via drill 0.3, 0.35)
  Top 0.381: v87.63,73.66 88.27,73.03 88.27,67.31 U$21.P$1 | v16.51,85.85 16.65,85.99 U1.28
  Bottom 0.381: v87.63,73.66 40.64,73.66 38.73,75.56 17.4,75.56 15.49,77.47 15.49,84.84 v16.51,85.85
N$41  (via drill 0.35)
  Top 0.381: U$21.P$2 91.27,72.31 v91.19,72.39 | v50.29,72.39 v50.29,92.96 | U1.27 17.65,87.63 17.65,88.29 18.51,89.15 v22.1,89.15
  Bottom 0.381: v91.19,72.39 v50.29,72.39 | v50.29,92.96 27.69,92.96 23.88,89.15 v22.1,89.15
NIX1  (via drill 0.3, 0.35)
  Top 0.381: v25.4,80.01 26.04,79.38 IC2.1 | v36.2,79.38 38.1,79.38 IC3.1 | v57.15,76.83 57.15,65.41 U$9.P$1 | U1.26 18.25,84.62 v18.29,84.58
  Bottom 0.381: v57.15,76.83 54.61,79.38 v36.2,79.38 26.04,79.38 v25.4,80.01 22.1,80.01 18.29,83.57 v18.29,84.58
NIX2  (via drill 0.3, 0.35)
  Top 0.381: 27.3,77.47 v26.67,76.83 | 27.3,77.47 27.3,78.74 IC2.2 | 19.05,87.63 U1.25 19.05,87.4 v19.05,86.36 | 37.47,67.94 37.47,62.23 36.83,61.59 34.92,61.59 34.92,67.31 32.38,69.85 32.38,72.39 27.3,77.47 | 37.47,67.94 37.47,75.56 39.37,77.47 39.37,78.74 IC3.2 | v41.91,66.67 40.64,67.94 37.47,67.94
  Bottom 0.381: v41.91,66.67 58.42,66.67 59.69,65.41 U$9.P$2 | v26.67,76.83 24.19,76.83 17.55,83.47 17.49,83.47 17.14,83.82 17.14,84.45 v19.05,86.36
NIX3  (via drill 0.3, 0.35)
  Top 0.381: v29.21,76.83 29.21,78.11 28.57,78.74 IC2.3 | v40.01,76.83 40.64,77.47 40.64,78.74 IC3.3 | v58.42,74.93 58.42,69.22 62.23,65.41 U$9.P$3 | U1.24 20.29,85.77 19.6,85.77 18.96,85.13 18.96,84.3 18.22,83.57 16.51,83.57 v16.51,82.04
  Bottom 0.381: v58.42,74.93 57.78,75.56 41.27,75.56 v40.01,76.83 v29.21,76.83 28.57,76.2 26.95,76.2 26.94,76.19 18.55,76.19 16.51,78.23 v16.51,82.04
NIX4  (via drill 0.3)
  Top 0.381: v22.23,85.72 22.23,85.09 20.95,85.09 U1.23 | v29.84,83.19 29.84,79.38 IC2.4 | v44.45,83.19 44.45,79.38 IC3.6 | v59.69,83.19 59.69,70.48 64.77,65.41 U$9.P$4
  Bottom 0.381: v22.23,85.72 22.23,83.19 v29.84,83.19 v44.45,83.19 v59.69,83.19
NIXIE0  (via drill 0.3)
  Top 0.381: v46.35,47.62 46.35,63.5 IC1.16 | v67.31,18.41 66.67,17.78 66.67,11.43 U$12.P$1 | v66.04,26.67 66.04,23.5 U$11.P$1 | 92.08,20.95 92.08,12.7 93.34,11.43 U$16.P$1 | 92.08,20.95 93.34,22.23 U$15.P$1 | 92.08,32.38 93.34,33.66 U$14.P$1 | 92.08,20.95 v92.08,27.94 92.08,32.38 | 92.08,32.38 92.08,42.55 93.34,43.81 U$13.P$1 | v115.57,34.29 v115.57,44.45 115.57,60.96 116.84,62.23 116.84,63.5 115.57,64.77 U$22.P$1
  Bottom 0.381: U$4.P$1 66.04,44.45 49.53,44.45 v46.35,47.62 45.09,47.62 45.09,26.67 59.69,12.06 65.41,12.06 66.04,11.43 U$12.P$1 | v67.31,18.41 64.77,18.41 64.77,21.59 66.04,22.86 U$11.P$1 | U$10.P$1 66.04,34.29 62.87,34.29 61.59,33.02 61.59,31.11 v66.04,26.67 67.31,27.94 v92.08,27.94 | v115.57,34.29 120.02,34.29 U$18.P$1 | U$17.P$1 120.02,44.45 v115.57,44.45 111.12,40.01 104.78,40.01 104.78,45.09 103.5,46.35 95.89,46.35 93.98,44.45 U$13.P$1
NIXIE1  (via drill 0.3, 0.35)
  Top 0.381: v121.28,37.47 121.28,35.56 122.56,34.29 U$18.P$3 | v118.11,38.1 118.11,46.99 119.38,48.26 | 119.38,48.26 122.56,48.26 122.56,44.45 U$17.P$3 | 119.38,48.26 119.38,63.5 118.11,64.77 U$22.P$3 | v67.31,26.04 67.31,24.77 68.58,23.5 U$11.P$3 | v65.41,36.2 65.41,38.1 64.77,38.73 64.77,45.72 67.31,45.72 68.58,44.45 U$4.P$3 | U$16.P$3 95.89,11.43 95.89,12.7 94.61,13.97 94.61,20.32 95.25,20.95 95.25,21.59 95.89,22.23 U$15.P$3 95.89,22.86 95.25,23.5 95.25,30.48 94.61,31.11 94.61,32.38 95.89,33.66 U$14.P$3 95.89,34.29 95.89,34.92 94.61,36.2 94.61,42.55 95.89,43.81 U$13.P$3 96.52,44.45 96.52,53.34 v109.86,66.67 | IC1.15 44.96,62.37 v44.96,50.29
  Bottom 0.381: v121.28,37.47 120.65,38.1 v118.11,38.1 | v67.31,26.04 66.67,25.4 66.04,25.4 63.5,27.94 | 63.5,27.94 60.96,30.48 60.96,35.56 65.41,35.56 | 65.41,35.56 67.31,35.56 68.58,34.29 U$10.P$3 | 65.41,35.56 v65.41,36.2 | U$16.P$3 95.89,10.79 95.25,10.16 69.85,10.16 69.22,10.79 U$12.P$3 68.58,11.43 67.31,12.7 60.33,12.7 60.33,24.77 63.5,27.94 | v109.86,66.67 116.84,66.67 118.11,65.41 U$22.P$3 | v44.96,50.29 49.53,50.29 52.58,47.24 67.06,47.24 68.92,45.38 U$4.P$3
NIXIE2  (via drill 0.3, 0.35)
  Top 0.381: v67.94,15.24 67.94,14.61 71.12,11.43 U$12.P$5 | v61.59,24.77 v61.59,36.83 v61.59,46.35 69.22,46.35 71.12,44.45 U$4.P$5 | v121.92,62.87 121.92,62.23 123.19,60.96 123.19,46.35 125.09,44.45 U$17.P$5 | U$16.P$5 98.42,11.43 97.79,12.06 97.79,18.41 97.16,19.05 97.16,20.32 98.42,21.59 98.42,22.23 U$15.P$5 98.42,22.86 97.79,23.5 97.79,30.48 97.16,31.11 97.16,32.38 98.42,33.66 U$14.P$5 98.42,34.29 98.42,34.92 97.16,36.2 97.16,42.55 98.42,43.81 U$13.P$5 99.06,44.45 99.06,50.8 v107.31,59.05 | v81.92,35.56 73.03,35.56 71.75,34.29 U$10.P$5 | v40.64,66.67 42.67,64.64 42.67,50.55 43.94,49.28 v44.96,49.28
  Bottom 0.381: v40.64,66.67 29.97,66.67 28.51,68.14 IC1.8 | v67.94,15.24 67.31,15.88 64.77,15.88 63.5,17.14 63.5,24.77 | 63.5,24.77 69.85,24.77 71.12,23.5 U$11.P$5 | 63.5,24.77 v61.59,24.77 | 71.12,44.45 U$4.P$5 | U$22.P$5 120.65,64.77 121.92,64.77 v121.92,62.87 121.92,59.05 v107.31,59.05 | v81.92,35.56 97.16,35.56 98.42,34.29 U$14.P$5 99.06,34.29 100.33,33.02 124.46,33.02 125.09,33.66 U$18.P$5 | v61.59,36.83 64.77,36.83 65.41,37.47 67.94,37.47 71.12,34.29 U$10.P$5 | v44.96,49.28 48.26,49.28 51.18,46.35 v61.59,46.35
NIXIE3  (via drill 0.3)
  Top 0.381: v80.64,12.06 80.64,12.7 75.56,12.7 74.3,11.43 U$12.P$7 | U$16.P$7 100.97,11.43 100.33,12.06 100.33,18.41 99.69,19.05 99.69,20.32 100.97,21.59 100.97,22.23 U$15.P$7 100.97,22.86 100.97,24.13 v100.33,24.77 99.69,25.4 99.69,32.38 100.97,33.66 U$14.P$7 100.97,34.29 100.97,36.83 v100.33,37.47 99.69,38.1 99.69,42.55 100.97,43.81 U$13.P$7 100.97,44.45 v100.97,48.26 | v125.09,36.83 127.64,34.29 U$18.P$7 | v124.46,62.87 v124.46,48.26 124.46,47.62 127.64,44.45 U$17.P$7 | v32.38,51.05 32.38,59.69 28.57,63.5 IC1.9
  Bottom 0.381: v80.64,12.06 81.28,12.7 83.19,12.7 83.82,12.06 92.08,12.06 92.71,12.7 99.69,12.7 100.97,11.43 U$16.P$7 | v100.33,24.77 93.98,24.77 91.44,27.3 74.3,27.3 74.3,23.5 U$11.P$7 | U$10.P$7 74.3,34.29 77.47,37.47 v100.33,37.47 101.6,36.2 124.46,36.2 v125.09,36.83 | v124.46,62.87 124.46,64.77 123.19,64.77 U$22.P$7 | 69.85,48.26 73.66,44.45 U$4.P$7 | 69.85,48.26 v100.97,48.26 v124.46,48.26 | 69.85,48.26 53.85,48.26 51.05,51.05 v32.38,51.05
NIXIE4  (via drill 0.3, 0.35)
  Top 0.381: v65.41,55.24 76.2,44.45 U$4.P$9 | v85.09,26.04 85.09,12.7 82.55,10.16 76.83,10.16 76.83,10.79 U$12.P$9 | U$17.P$9 130.18,44.45 127,47.62 127,63.5 125.73,64.77 U$22.P$9 | v109.86,60.33 104.14,54.61 104.14,44.45 U$13.P$9 103.5,43.81 102.23,42.55 102.23,39.37 103.5,38.1 103.5,34.29 U$14.P$9 103.5,33.66 102.23,32.38 102.23,31.11 102.87,30.48 102.87,23.5 103.5,22.86 U$15.P$9 103.5,22.23 103.5,21.59 102.23,20.32 102.23,19.05 102.87,18.41 102.87,12.06 103.5,11.43 U$16.P$9 | IC1.13 38.67,56.83 v38.86,56.64
  Bottom 0.381: U$12.P$9 76.83,11.43 76.83,14.61 104.78,14.61 107.31,12.06 107.31,10.16 105.41,10.16 104.14,11.43 U$16.P$9 | v85.09,26.04 79.38,26.04 76.83,23.5 U$11.P$9 | 102.23,35.56 100.97,35.56 99.69,36.83 79.38,36.83 76.83,34.29 U$10.P$9 | 102.23,35.56 103.5,34.29 U$14.P$9 | 102.23,35.56 128.91,35.56 130.18,34.29 U$18.P$9 | v109.86,60.33 119.38,60.33 119.38,66.04 120.02,66.67 124.46,66.67 125.73,65.41 U$22.P$9 | U$4.P$9 76.83,44.45 78.11,45.72 87.63,45.72 93.34,40.01 98.42,40.01 99.69,41.27 99.69,45.72 102.23,45.72 103.5,44.45 U$13.P$9 | v38.86,56.64 38.99,56.52 38.99,56.26 39.37,55.88 63.22,55.88 63.23,55.89 64.76,55.89 v65.41,55.24
NIXIE5  (via drill 0.3, 0.35)
  Top 0.381: 73.66,50.8 78.74,45.72 78.74,44.45 U$4.P$11 | 73.66,50.8 v70.48,53.98 | 73.66,50.8 80.01,50.8 83.82,46.99 v83.82,33.02 v83.82,24.77 v83.82,13.34 | v137.16,36.2 137.79,36.83 137.79,43.81 135.89,45.72 133.35,45.72 | 133.35,45.72 133.35,44.45 U$17.P$11 | 133.35,45.72 129.54,49.53 129.54,63.5 128.27,64.77 U$22.P$11 | 107.31,21.59 106.68,22.23 U$15.P$11 | 107.31,21.59 107.31,12.06 106.68,11.43 U$16.P$11 | 107.31,32.38 106.05,33.66 U$14.P$11 | 107.31,21.59 107.31,32.38 | 107.31,32.38 107.31,43.18 106.68,43.81 U$13.P$11 | IC1.14 41.21,56.83 v41.15,56.64
  Bottom 0.381: v83.82,24.77 80.64,24.77 79.38,23.5 U$11.P$11 | v83.82,33.02 80.01,33.02 79.38,33.66 U$10.P$11 | v137.16,36.2 135.25,36.2 133.35,34.29 U$18.P$11 | U$12.P$11 79.38,11.43 79.38,13.34 v83.82,13.34 104.14,13.34 106.05,11.43 U$16.P$11 | U$17.P$11 132.72,44.45 131.44,45.72 107.95,45.72 106.68,44.45 U$13.P$11 | v70.48,53.98 67.82,56.64 v41.15,56.64
NIXIE6  (via drill 0.3)
  Top 0.381: U$18.P$13 135.89,34.29 135.89,40.01 137.16,41.27 137.16,42.55 135.89,43.81 U$17.P$13 | U$13.P$13 109.22,43.81 109.86,43.18 109.86,34.92 109.22,34.29 U$14.P$13 108.58,33.66 109.86,32.38 109.86,24.13 108.58,22.86 U$15.P$13 109.22,22.23 109.22,20.95 109.86,20.32 109.86,12.06 109.22,11.43 U$16.P$13 | U$12.P$13 81.92,11.43 82.55,12.06 82.55,19.68 83.19,20.32 83.19,21.59 81.92,22.86 U$11.P$13 81.92,23.5 82.55,24.13 82.55,30.48 83.19,31.11 83.19,32.38 81.92,33.66 U$10.P$13 81.92,34.29 83.19,35.56 83.19,42.55 81.92,43.81 U$4.P$13 81.28,44.45 81.28,48.26 v80.01,49.53 | v34.29,59.05 34.29,62.87 33.66,63.5 IC1.11
  Bottom 0.381: 132.08,49.53 132.08,46.35 133.35,46.35 135.25,44.45 U$17.P$13 | 132.08,49.53 132.08,63.5 130.81,64.77 U$22.P$13 | v34.29,59.05 70.48,59.05 v80.01,49.53 132.08,49.53 | U$15.P$13 108.58,22.86 107.95,23.5 81.92,23.5 U$11.P$13
NIXIE7  (via drill 0.3)
  Top 0.381: U$12.P$2 66.04,8.89 64.77,10.16 64.77,15.88 66.04,17.14 66.04,20.32 U$11.P$2 66.04,20.95 64.77,22.23 64.77,29.21 66.04,30.48 66.04,31.11 U$10.P$2 66.04,31.75 64.77,33.02 64.77,34.29 66.67,36.2 66.67,41.27 U$4.P$2 | v46.35,45.72 33.02,59.05 33.02,61.59 31.11,63.5 IC1.10 | U$18.P$2 120.02,31.75 118.11,33.66 118.11,36.83 120.02,38.73 120.02,41.27 U$17.P$2 120.02,41.91 118.75,43.18 118.75,46.35 v119.38,46.99 | v109.86,67.94 94.61,52.7 94.61,43.81 93.98,43.18 93.98,41.91 U$13.P$2 93.98,41.27 93.98,35.56 94.61,34.92 94.61,33.66 93.98,33.02 93.98,31.75 U$14.P$2 93.34,31.11 94.61,29.84 94.61,21.59 93.34,20.32 U$15.P$2 93.98,19.68 93.98,13.34 94.61,12.7 94.61,9.53 93.98,8.89 U$16.P$2 93.34,8.26 93.34,6.35 v74.93,6.35
  Bottom 0.381: v46.35,45.72 50.16,41.91 66.04,41.91 U$4.P$2 | v109.86,67.94 130.81,67.94 133.35,65.41 U$22.P$15 | v119.38,46.99 93.98,46.99 92.08,45.09 92.08,42.55 92.71,42.55 93.34,41.91 U$13.P$2 | v74.93,6.35 68.58,6.35 66.67,8.26 U$12.P$2
NIXIE8  (via drill 0.3)
  Top 0.381: U$17.P$4 122.56,41.27 122.56,40.01 118.75,36.2 118.75,34.29 120.02,33.02 121.28,33.02 122.56,31.75 U$18.P$4 122.56,31.11 v122.56,29.21 | 97.16,15.88 97.16,17.78 96.52,18.41 96.52,19.68 U$15.P$4 95.89,20.32 97.16,21.59 97.16,29.84 95.89,31.11 U$14.P$4 96.52,31.75 96.52,33.02 97.16,33.66 97.16,34.92 96.52,35.56 96.52,41.27 U$13.P$4 | 97.16,15.88 97.16,9.53 96.52,8.89 U$16.P$4 | 64.14,8.89 65.41,7.62 68.58,7.62 68.58,8.26 U$12.P$4 | 64.14,8.89 52.7,20.32 52.7,64.77 46.35,71.12 IC1.1 | 64.14,8.89 64.14,16.51 v64.77,17.14 63.5,18.41 63.5,32.38 v62.87,33.02 62.87,39.37 v63.5,40.01 | v95.89,15.88 97.16,15.88
  Bottom 0.381: v122.56,29.21 99.06,29.21 96.52,31.75 U$14.P$4 | 68.58,17.14 68.58,20.32 U$11.P$4 | v64.77,17.14 68.58,17.14 | v62.87,33.02 67.31,33.02 68.58,31.75 U$10.P$4 | v63.5,40.01 67.31,40.01 68.58,41.27 U$4.P$4 | U$22.P$17 135.89,65.41 130.18,71.12 46.35,71.12 IC1.1 | v95.89,15.88 69.85,15.88 68.58,17.14
NIXIE9  (via drill 0.3)
  Top 0.381: v64.77,30.48 64.14,31.11 v64.14,38.1 | 52.07,38.1 52.07,19.68 64.77,6.99 71.12,6.99 71.12,8.26 U$12.P$6 71.75,8.26 74.93,5.08 98.42,5.08 98.42,8.26 U$16.P$6 99.06,8.89 99.69,9.53 99.69,17.78 99.06,18.41 99.06,19.68 U$15.P$6 98.42,20.32 99.69,21.59 99.69,24.13 98.42,25.4 98.42,31.11 U$14.P$6 99.06,31.75 99.06,33.02 99.69,33.66 99.69,36.83 99.06,37.47 99.06,41.27 U$13.P$6 | 52.07,38.1 52.07,62.87 43.81,71.12 IC1.2 | 52.07,38.1 v51.44,38.1 | v116.84,40.01 116.84,33.66 122.56,27.94 125.09,27.94 125.09,30.48 | 125.09,30.48 125.09,31.11 U$18.P$6 | 125.09,30.48 136.53,30.48 139.7,33.66 139.7,63.5 138.43,64.77 U$22.P$19
  Bottom 0.381: v64.77,30.48 70.48,30.48 71.12,31.11 U$10.P$6 | U$4.P$6 71.12,41.27 69.22,39.37 65.41,39.37 v64.14,38.1 v51.44,38.1 | U$11.P$6 71.75,20.32 73.66,18.41 97.16,18.41 98.42,19.68 U$15.P$6 | U$18.P$6 125.09,31.11 124.46,30.48 111.12,30.48 110.49,29.84 99.69,29.84 98.42,31.11 U$14.P$6 | v116.84,40.01 123.83,40.01 125.09,41.27 U$17.P$6
NIXIE_ANODE1  (via drill 0.3)
  Top 0.381: v128.27,78.74 130.18,76.83 130.18,67.94 132.08,66.04 132.08,64.14 133.35,62.87 U$22.P$16 | v86.36,82.55 v86.36,44.45
  Bottom 0.381: v128.27,78.74 127,78.74 127,81.28 123.83,84.45 98.42,84.45 96.52,82.55 v86.36,82.55 80.01,82.55 78.74,81.28 U$3.P$15 | v86.36,44.45 81.92,40.01 80.64,40.01 79.38,41.27 U$4.P$12
NIXIE_ANODE2  (via drill 0.3)
  Top 0.381: v85.09,33.02 85.09,46.99 83.82,48.26 v83.82,57.78 83.82,82.55 74.93,82.55 73.66,81.28 U$3.P$13
  Bottom 0.381: v85.09,33.02 82.55,30.48 80.01,30.48 79.38,31.11 U$10.P$12 | v83.82,57.78 126.36,57.78 130.81,62.23 U$22.P$14
NIXIE_ANODE3  (via drill 0.3)
  Top 0.381: v90.81,83.82 93.34,86.36 127,86.36 127,64.77 128.27,63.5 U$22.P$12 | v74.93,13.97 78.11,17.14 78.11,19.68 78.74,20.32 U$11.P$12 | v62.87,13.97 53.34,23.5 53.34,84.45 55.88,87 67.94,87 67.94,81.28 U$3.P$11
  Bottom 0.381: v90.81,83.82 71.12,83.82 68.58,81.28 U$3.P$11 | v62.87,13.97 v74.93,13.97
NIXIE_ANODE4  (via drill 0.3)
  Top 0.381: U$22.P$10 125.73,62.87 124.46,64.14 v124.46,85.09 93.34,85.09 90.17,81.92 90.17,6.99 80.64,6.99 79.38,8.26 U$12.P$12
  Bottom 0.381: v124.46,85.09 67.31,85.09 63.5,81.28 U$3.P$9
NIXIE_ANODE5  (via drill 0.3)
  Top 0.381: U$5.P$15 106.68,81.28 107.95,82.55 111.12,82.55 111.12,51.44 104.78,45.09 104.78,43.18 106.05,41.91 U$13.P$12 | v121.92,74.3 121.92,64.14 123.19,62.87 U$22.P$8
  Bottom 0.381: v121.92,74.3 116.2,80.01 107.95,80.01 106.68,81.28 U$5.P$15
NIXIE_ANODE6  (via drill 0.3)
  Top 0.381: 111.76,84.45 118.75,84.45 118.75,66.67 119.38,66.04 119.38,64.77 120.65,63.5 U$22.P$6 | 111.76,84.45 104.78,84.45 101.6,81.28 U$5.P$13 | v111.12,31.75 111.76,32.38 111.76,84.45
  Bottom 0.381: v111.12,31.75 109.86,30.48 107.95,30.48 106.68,31.75 U$14.P$12
NIXIE_ANODE7  (via drill 0.3)
  Top 0.381: v113.03,83.19 116.84,79.38 116.84,68.58 | 116.84,68.58 116.84,64.77 118.11,63.5 U$22.P$4 | v110.49,20.95 113.67,24.13 113.67,65.41 116.84,68.58
  Bottom 0.381: v113.03,83.19 98.42,83.19 96.52,81.28 U$5.P$11 | v110.49,20.95 107.95,20.95 106.68,19.68 U$15.P$12
NIXIE_ANODE8  (via drill 0.3)
  Top 0.381: v92.08,69.85 92.08,80.64 91.44,81.28 U$5.P$9 | U$16.P$12 106.68,8.89 107.95,10.16 114.3,10.16 114.3,60.96 115.57,62.23 U$22.P$2
  Bottom 0.381: v92.08,69.85 98.42,63.5 114.94,63.5 115.57,62.87 U$22.P$2
NIXIE_ANODE9  (via drill 0.3)
  Top 0.381: v137.16,62.23 137.16,66.04 139.7,68.58 139.7,76.2 137.16,76.2 136.53,76.83 136.53,80.64 135.89,81.28 U$6.P$15
  Bottom 0.381: v137.16,62.23 137.16,40.01 134.62,40.01 133.35,41.27 U$17.P$12
NIXIE_ANODE10  (via drill 0.3)
  Top 0.381: v140.34,33.02 140.34,82.55 132.08,82.55 130.81,81.28 U$6.P$13
  Bottom 0.381: v140.34,33.02 137.79,30.48 133.99,30.48 133.35,31.11 U$18.P$12
RHDP  (via drill 0.3)
  Top 0.381: v13.34,95.25 13.34,87.63 U1.32
  Bottom 0.381: v13.34,95.25 14.61,96.52 112.39,96.52 120.02,88.9 U$6.P$8
RXI  (via drill 0.35)
  Top 0.381: U1.30 15.05,89.09
  Top 0.432: 15.05,89.09 v14.99,89.15 | U$1.3 22.94,94.85 22.9,94.81 22.9,93.52 21.84,92.46 17.53,92.46 v17.53,89.15
  Bottom 0.432: v14.99,89.15 v17.53,89.15
TXO  (via drill 0.35)
  Top 0.381: U1.31 14.23,90.16
  Top 0.432: 14.23,90.16 v14.22,90.17 | U$1.2 22.21,95.03 22.21,94.29 21.39,93.47 17.02,93.47 16.76,93.22 v16.76,90.17
  Bottom 0.432: v14.22,90.17 v16.76,90.17